# EAGLE design emonDCduo-STM32_v0.2 (EAGLE 9.6.2)
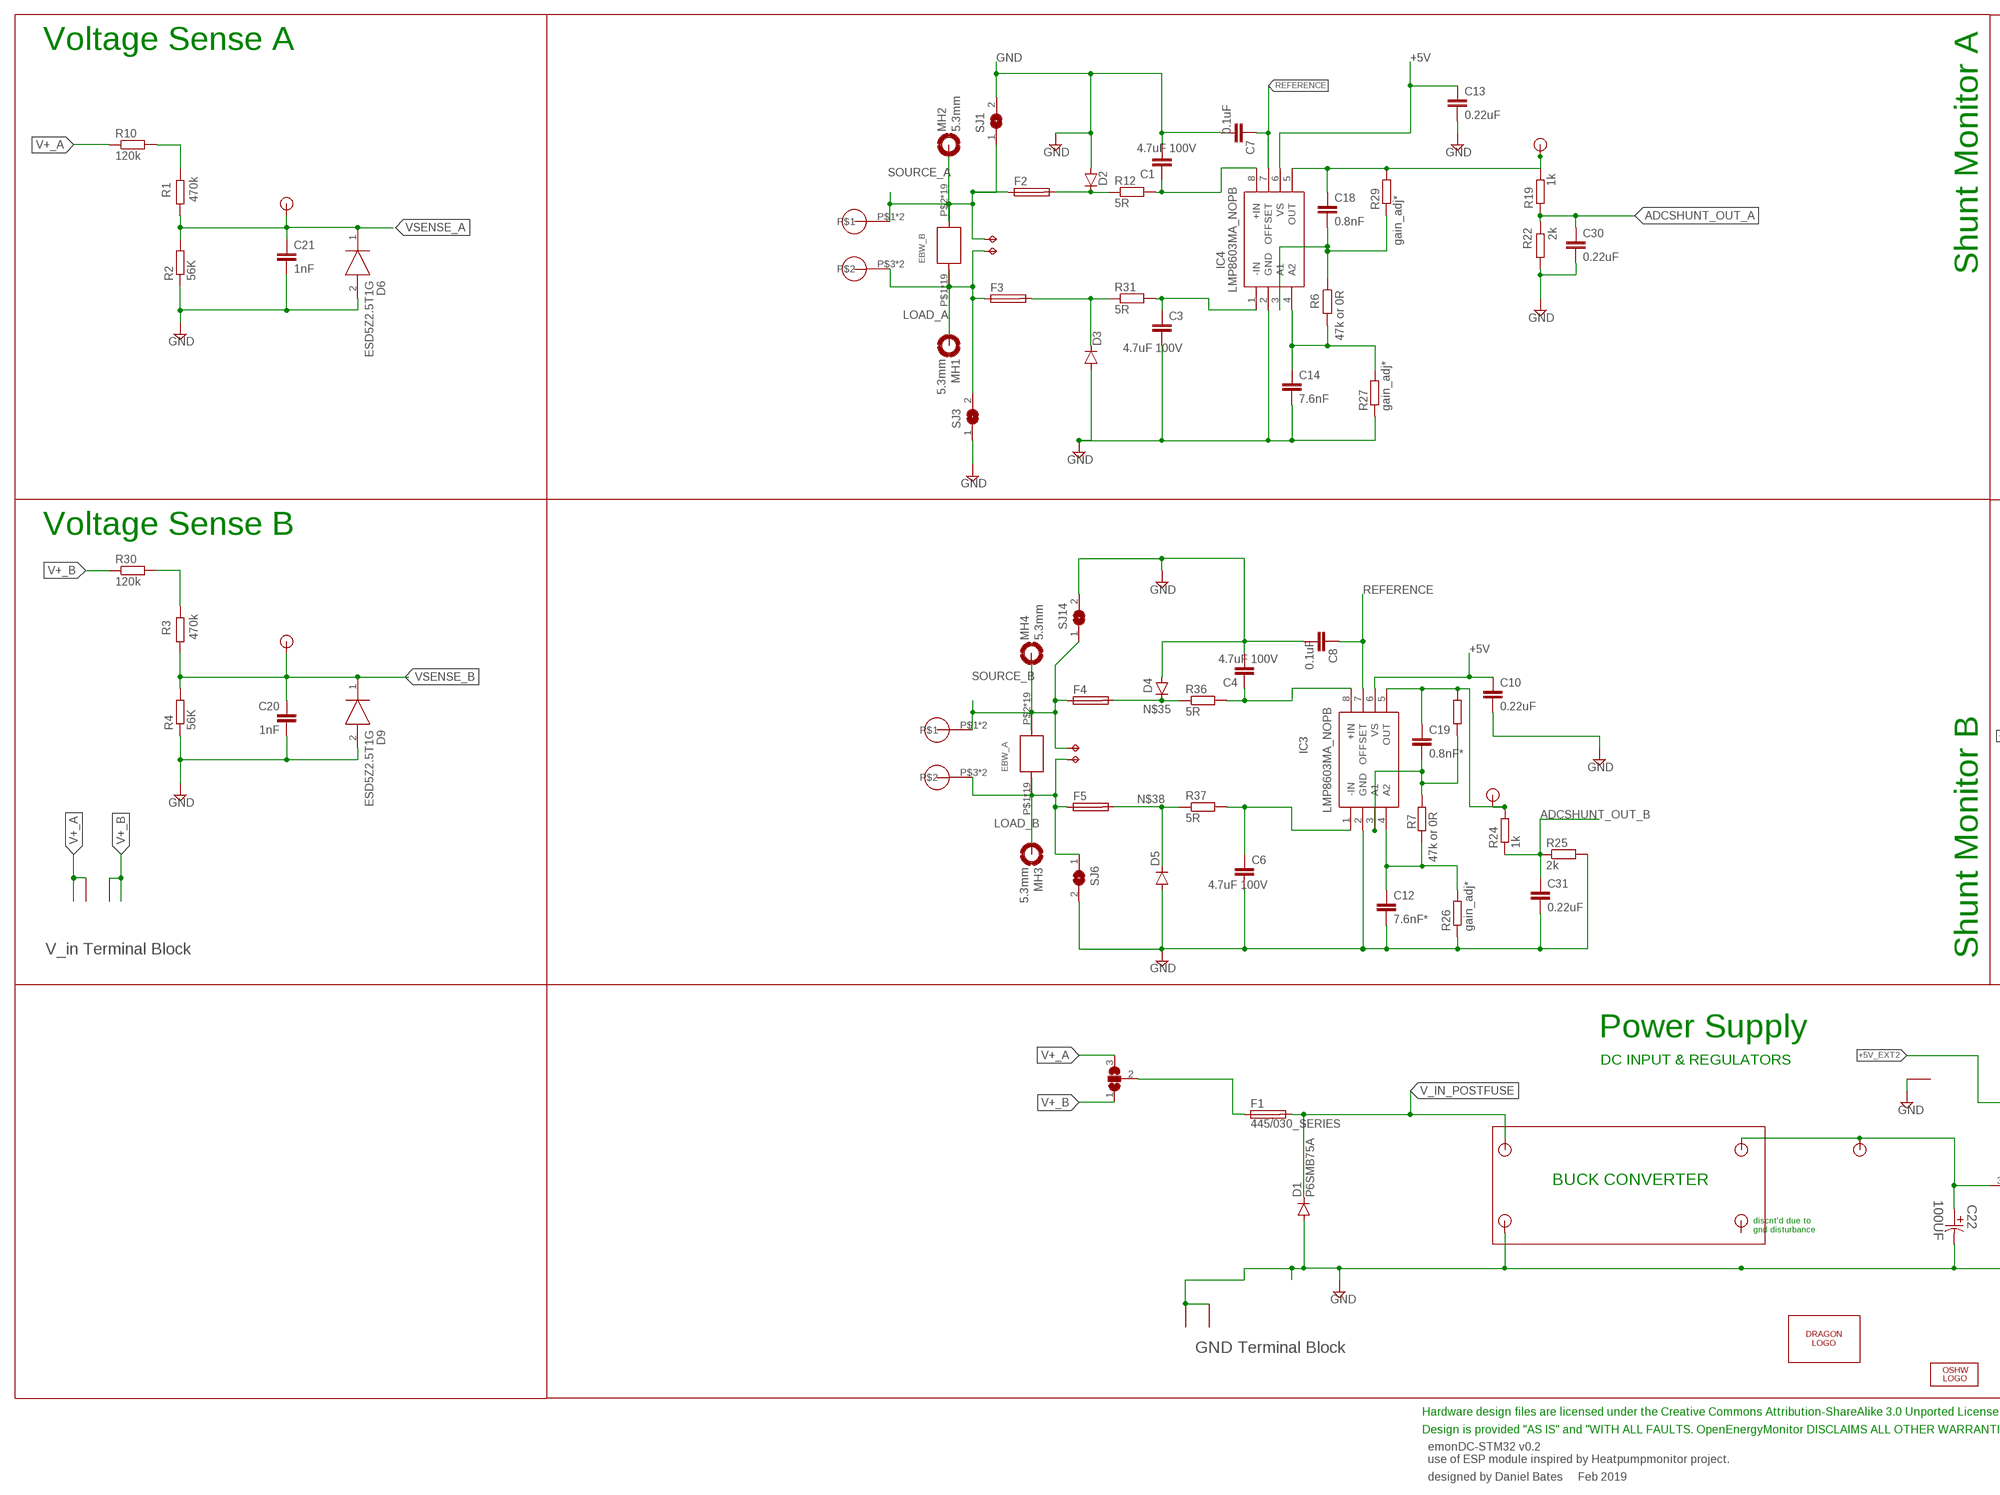
[diagram p0: schematic, sheet 1, part 1 of 2]
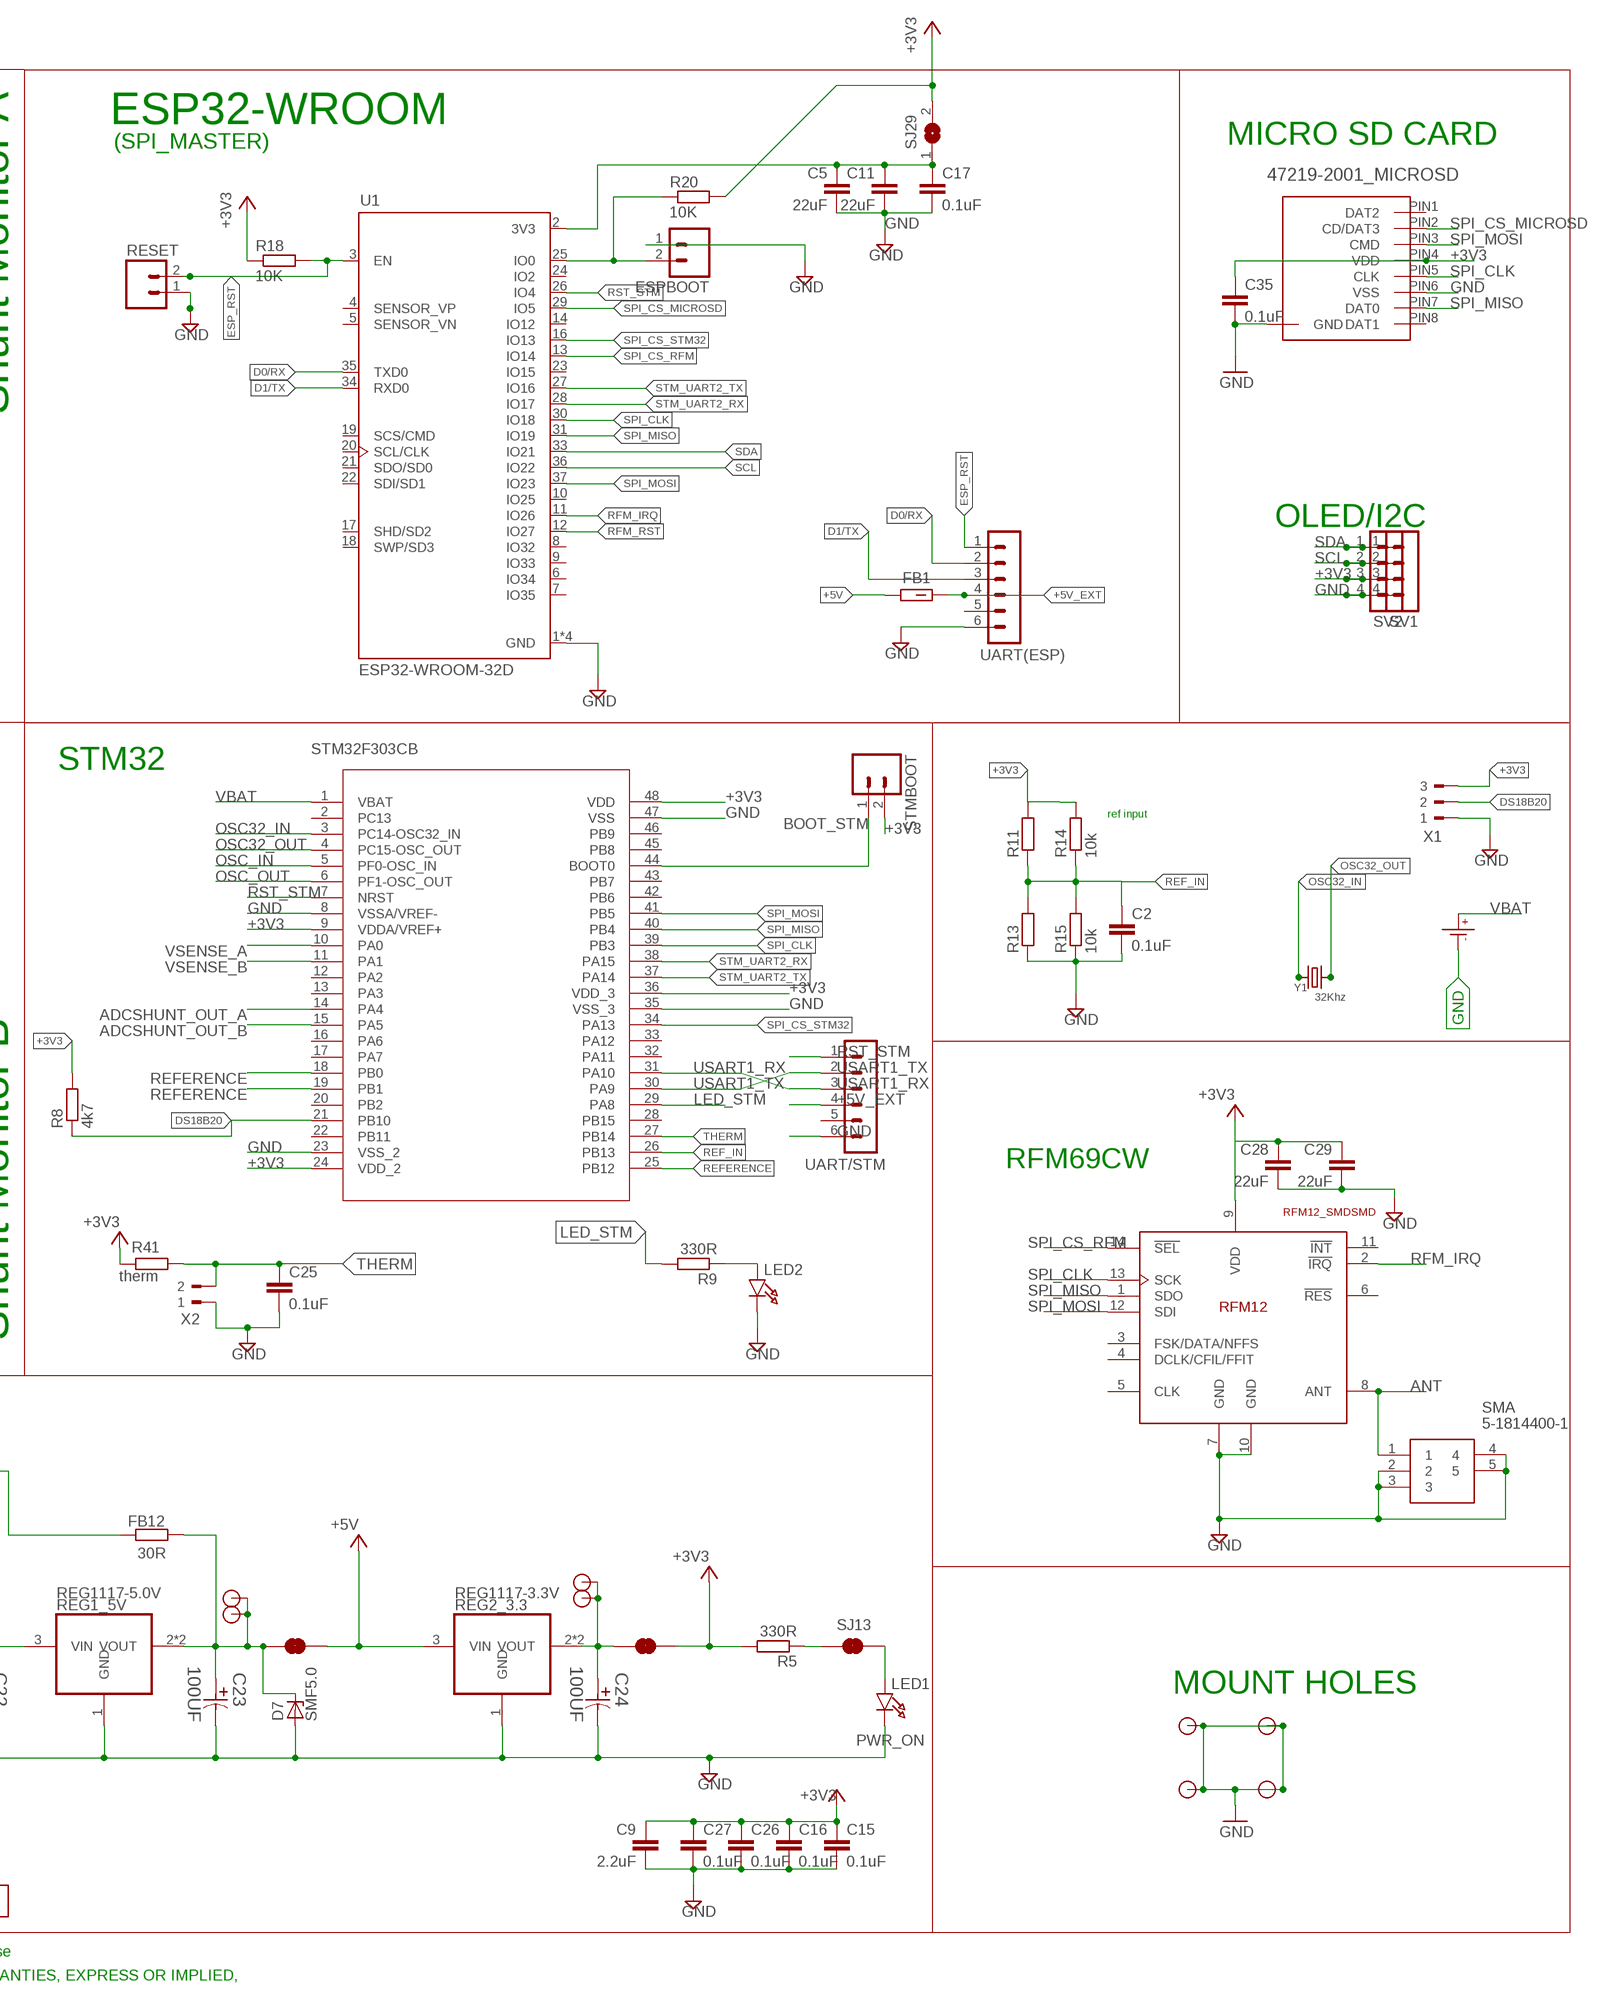
[diagram p1: schematic, sheet 1, part 2 of 2]

## Parts
3V3  JUMPER-SMT_2_NC_TRACE_NO-SILK  [SMT-JUMPER_2_NC_TRACE_NO-SILK]
5V  JUMPER-SMT_2_NC_TRACE_NO-SILK  [SMT-JUMPER_2_NC_TRACE_NO-SILK]
C1  4.7uF 100V  C-EUC1206  [C1206]
C2  0.1uF  C-EUC0603  [C0603]
C3  4.7uF 100V  C-EUC1206  [C1206]
C4  4.7uF 100V  C-EUC1206  [C1206]
C5  22uF  C-EUC0805  [C0805]
C6  4.7uF 100V  C-EUC1206  [C1206]
C7  0.1uF  C-EUC0603  [C0603]
C8  0.1uF  C-EUC0603  [C0603]
C9  2.2uF  C-EUC0805  [C0805]
C10  0.22uF  C-EUC0603  [C0603]
C11  22uF  C-EUC0805  [C0805]
C12  7.6nF*  C-EUC0603  [C0603]
C13  0.22uF  C-EUC0603  [C0603]
C14  7.6nF  C-EUC0603  [C0603]
C15  0.1uF  C-EUC0603  [C0603]
C16  0.1uF  C-EUC0603  [C0603]
C17  0.1uF  C-EUC0603  [C0603]
C18  0.8nF  C-EUC0603  [C0603]
C19  0.8nF*  C-EUC0603  [C0603]
C20  1nF  C-EUC0603  [C0603]
C21  1nF  C-EUC0603  [C0603]
C22  100UF  EEE-0JA101WAR-CASE-C  [CAPAE530X610N]
C23  100UF  EEE-0JA101WAR-CASE-C  [CAPAE530X610N]
C24  100UF  EEE-0JA101WAR-CASE-C  [CAPAE530X610N]
C25  0.1uF  C-EUC0603  [C0603]
C26  0.1uF  C-EUC0603  [C0603]
C27  0.1uF  C-EUC0603  [C0603]
C28  22uF  C-EUC0805  [C0805]
C29  22uF  C-EUC0805  [C0805]
C30  0.22uF  C-EUC0603  [C0603]
C31  0.22uF  C-EUC0603  [C0603]
C35  0.1uF  C-EUC0603  [C0603]
CR1220  CR1220SMD  [CR1220SMD]
D1  P6SMB75A  DIODE-DO214AA  [DO214AA]
D2  P6SMB75A  DIODE-SMB  [SMB]
D3  P6SMB75A  DIODE-SMB  [SMB]
D4  P6SMB75A  DIODE-SMB  [SMB]
D5  P6SMB75A  DIODE-SMB  [SMB]
D6  ESD5Z2.5T1G  [SODFL1608X70N]
D7  SMF5.0  SMF6.0A  [SOD123F]
D9  ESD5Z2.5T1G  [SODFL1608X70N]
EBW_A  EBW_SERIES_15.2MM  [EBW_SERIES_15.2MM]
EBW_B  EBW_SERIES_15.2MM  [EBW_SERIES_15.2MM]
ESPBOOT  M02PTH  [1X02]
F1  445/030_SERIES  [445/030_SERIES_LITTELFUSE]
F2  TR5  [TR5]
F3  TR5  [TR5]
F4  TR5  [TR5]
F5  TR5  [TR5]
FB1  FBCHIP-0603(1608-METRIC)  [BEADC1608X95N]
FB12  30R  R-EU_R0603  [R0603]
IC3  LMP8603MA_NOPB  [SOIC127P600X175-8N]
IC4  LMP8603MA_NOPB  [SOIC127P600X175-8N]
LED1  PWR_ON  LED1206  [CHIPLED_1206]
LED2  PWR_ON  LED1206  [CHIPLED_1206]
LOGO1  OSHW_LOGO_6MILX0200-NT  [OSHW_6X200_NOTEXT]
MH1  5.3mm  MOUNT-PAD-ROUND5.3  [5,3//11-PAD]
MH2  5.3mm  MOUNT-PAD-ROUND5.3  [5,3//11-PAD]
MH3  5.3mm  MOUNT-PAD-ROUND5.3  [5,3//11-PAD]
MH4  5.3mm  MOUNT-PAD-ROUND5.3  [5,3//11-PAD]
MICRO_SD  47219-2001_MICROSD  [47219-2001_MICROSD]
MOUNT_10.16_A  MOLEX_39970-003  [2/10,16]
MOUNT_10.16_B  MOLEX_39970-003  [2/10,16]
R1  470k  R-EU_0207/2V  [0207/2V]
R2  56K  R-EU_R0603  [R0603]
R3  470k  R-EU_0207/2V  [0207/2V]
R4  56K  R-EU_R0603  [R0603]
R5  330R  R-EU_R0603  [R0603]
R6  47k or 0R  R-EU_R0603  [R0603]
R7  47k or 0R  R-EU_R0603  [R0603]
R8  4k7  R-EU_R0603  [R0603]
R9  330R  R-EU_R0603  [R0603]
R10  120k  R-EU_R0603  [R0603]
R11  R-EU_0207/2V  [0207/2V]
R12  5R  R-EU_R0603  [R0603]
R13  R-EU_0207/2V  [0207/2V]
R14  10k  R-EU_R0603  [R0603]
R15  10k  R-EU_R0603  [R0603]
R18  10K  R-EU_R0603  [R0603]
R19  1k  R-EU_R0603  [R0603]
R20  10K  R-EU_R0603  [R0603]
R22  2k  R-EU_R0603  [R0603]
R24  1k  R-EU_R0603  [R0603]
R25  2k  R-EU_R0603  [R0603]
R26  gain_adj*  R-EU_R0603  [R0603]
R27  gain_adj*  R-EU_R0603  [R0603]
R28  gain_adj*  R-EU_R0603  [R0603]
R29  gain_adj*  R-EU_R0603  [R0603]
R30  120k  R-EU_R0603  [R0603]
R31  5R  R-EU_R0603  [R0603]
R36  5R  R-EU_R0603  [R0603]
R37  5R  R-EU_R0603  [R0603]
R41  therm  R-EU_R0603  [R0603]
REG1_5V  REG1117-5.0V  REG1117  [SOT223]
REG2_3.3  REG1117-3.3V  REG1117  [SOT223]
RESET  M02PTH  [1X02]
SJ1  SJ  [SJ]
SJ3  SJ  [SJ]
SJ6  SJ  [SJ]
SJ13  JUMPER-SMT_2_NC_TRACE_NO-SILK  [SMT-JUMPER_2_NC_TRACE_NO-SILK]
SJ14  SJ  [SJ]
SJ15  SJ2W  [SJ_2]
SJ29  SJ  [SJ]
SMA  5-1814400-1  [518144001]
STM32F303CB  STM32F303CB_STM32F302_303C2  [STM32F303CB_LQFP48-7X7MM]
STMBOOT  M02PTH  [1X02]
SV1  MA04-1  [MA04-1]
SV2  MA04-1  [MA04-1]
TP8  TPPAD1-13Y  [P1-13Y]
TP9  TPPAD1-13Y  [P1-13Y]
TP10  TPPAD1-13Y  [P1-13Y]
TP11  TPPAD1-13Y  [P1-13Y]
U1  ESP32-WROOM-32D  [MODULE_ESP32-WROOM-32D]
U$1  TP0.8MM  [TP0.8]
U$2  2212S-02SG-85  TP_2_LONG  [TP0.8_X2]
U$3  2212S-02SG-85  TP_2_LONG  [TP0.8_X2]
U$4  TP0.8MM  [TP0.8]
U$5  TP0.8MM  [TP0.8]
U$6  TP0.8MM  [TP0.8]
U$7  TP0.8MM  [TP0.8]
U$8  TP0.8MM  [TP0.8]
U$9  TP0.8MM  [TP0.8]
U$10  2212S-02SG-85  TP_2_LONG  [TP0.8_X2]
U$11  2212S-02SG-85  TP_2_LONG  [TP0.8_X2]
U$14  RFM12_SMDSMD  [RFM12]
U$15  7.62MM_TERMINAL_BLOCK  [7.62MM]
U$16  7.62MM_TERMINAL_BLOCK  [7.62MM]
U$17  7.62MM_TERMINAL_BLOCK  [7.62MM]
U$18  TP0.8MM  [TP0.8]
U$19  TP0.8MM  [TP0.8]
U$22  TP3.5MM  [TP3.5]
U$23  TP3.5MM  [TP3.5]
U$24  TP3.5MM  [TP3.5]
U$25  TP3.5MM  [TP3.5]
U$26  DRAGON  [DRAGON_LOGO]
UART(ESP)  UART/ESP  MA06-1  [MA06-1]
UART/STM  UART/STM  MA06-1  [MA06-1]
X1  180-3  [180-3]
X2  180-2  [180-2]
Y1  32Khz  CRYSTAL8X3.8SMT  [CRYSTAL_8X3.8]

## Nets
3.3V_ [thick_power]: 3V3.1 C24.1 REG2_3.3.2(VOUT) REG2_3.3.4(VOUT) U$8.P$1 U$19.P$1
5V_ [thick_power]: 5V.1 C23.1 D7.C FB12.1 REG1_5V.2(VOUT) REG1_5V.4(VOUT) U$7.P$1 U$18.P$1
6.5V [thick_power]: C22.1 REG1_5V.3(VIN) U$9.P$1 U$10.P$1 U$10.P$2
+3V3 [thin_power]: 3V3.2 C9.1 C15.1 C16.1 C26.1 C27.1 C28.1 C29.1 C35.1 MICRO_SD.PIN4(VDD) R5.2 R8.2 R11.2 R14.2 R18.1 R20.2 R41.2 SJ29.2 STM32F303CB.9(VDDA/VREF+) STM32F303CB.24(VDD_2) STM32F303CB.36(VDD_3) STM32F303CB.48(VDD) STMBOOT.2 SV1.3 SV2.3 U$14.9(VDD) X1.3
+3V3_ESP [thin_power]: C5.1 C11.1 C17.1 SJ29.1 U1.2(3V3)
+5V [thick_power]: 5V.2 C10.1 C13.1 FB1.1 IC3.6(VS) IC4.6(VS) REG2_3.3.3(VIN)
+5V_EXT [thick_power]: FB1.2 UART(ESP).4 UART/STM.4
+5V_EXT2 [thick_power]: FB12.2 U$17.P$1
ADCSHUNT_OUT_A: C30.1 R19.1 R22.1 STM32F303CB.14(PA4)
ADCSHUNT_OUT_A_: C18.1 IC4.5(OUT) R19.2 R29.2 U$6.P$1
ADCSHUNT_OUT_B: C31.1 R24.1 R25.1 STM32F303CB.15(PA5)
ADCSHUNT_OUT_B_: C19.1 IC3.5(OUT) R24.2 R28.2 U$5.P$1
ANT: SMA.1 U$14.8(ANT)
BOOT_STM: STM32F303CB.44(BOOT0) STMBOOT.1
D0/RX: U1.35(TXD0) UART(ESP).2
D1/TX: U1.34(RXD0) UART(ESP).3
DS18B20: R8.1 STM32F303CB.21(PB10) X1.2
ESP_RST: R18.2 RESET.2 U1.3(EN) UART(ESP).1
GND: C1.2 C2.2 C3.2 C4.2 C5.2 C6.2 C7.2 C8.2 C9.2 C10.2 C11.2 C12.2 C13.2 C14.2 C15.2 C16.2 C17.2 C20.2 C21.2 C22.2 C23.2 C24.2 C25.2 C26.2 C27.2 C28.2 C29.2 C30.2 C31.2 C35.2 CR1220.P-(P$-) D1.A D2.A D3.A D4.A D5.A D6.2(A) D7.A D9.2(A) ESPBOOT.1 IC3.2(GND) IC4.2(GND) LED1.C LED2.C MICRO_SD.P$1(GND) MICRO_SD.P$2(GND) MICRO_SD.P$3(GND) MICRO_SD.P$4(GND) MICRO_SD.PIN6(VSS) R2.1 R4.1 R13.1 R15.1 R22.2 R25.2 R26.1 R27.1 REG1_5V.1(GND) REG2_3.3.1(GND) RESET.1 SJ1.2 SJ3.1 SJ6.2 SJ14.2 SMA.2 SMA.3 SMA.4 SMA.5 STM32F303CB.8(VSSA/VREF-) STM32F303CB.23(VSS_2) STM32F303CB.35(VSS_3) STM32F303CB.47(VSS) SV1.4 SV2.4 U1.1(GND) U1.15(GND) U1.38(GND) U1.39(GND) U$3.P$1 U$3.P$2 U$14.7(GND) U$14.10(GND) U$16.P$1 U$16.P$2 U$17.P$2 U$22.P$1 U$23.P$1 U$24.P$1 U$25.P$1 UART(ESP).6 UART/STM.6 X1.1 X2.1
LED_STM: R9.2 STM32F303CB.29(PA8)
LOAD_A [HV]: EBW_B.P$1 EBW_B.P$3 EBW_B.P$4 EBW_B.P$5 EBW_B.P$6 EBW_B.P$7 EBW_B.P$8 EBW_B.P$9 EBW_B.P$10 EBW_B.P$11 EBW_B.P$12 EBW_B.P$13 EBW_B.P$14 EBW_B.P$15 EBW_B.P$16 EBW_B.P$17 EBW_B.P$33 EBW_B.P$34 EBW_B.P$35 F3.1 MH1.B5,5(MOUNT) MOUNT_10.16_A.P$3 MOUNT_10.16_A.P$4 SJ3.2 TP10.TP
LOAD_B [HV]: EBW_A.P$1 EBW_A.P$3 EBW_A.P$4 EBW_A.P$5 EBW_A.P$6 EBW_A.P$7 EBW_A.P$8 EBW_A.P$9 EBW_A.P$10 EBW_A.P$11 EBW_A.P$12 EBW_A.P$13 EBW_A.P$14 EBW_A.P$15 EBW_A.P$16 EBW_A.P$17 EBW_A.P$33 EBW_A.P$34 EBW_A.P$35 F5.1 MH3.B5,5(MOUNT) MOUNT_10.16_B.P$3 MOUNT_10.16_B.P$4 SJ6.1 TP8.TP
LOAD_B_T [thin_power]: C6.1 IC3.1(-IN) R37.2
LOAD_T_A [thin_power]: C3.1 IC4.1(-IN) R31.2
N$3: C14.1 IC4.4(A2) R6.2 R27.2
N$4: C18.2 IC4.3(A1) R6.1 R29.1
N$5: R5.1 SJ13.1
N$6: LED1.A SJ13.2
N$10: F1.P$1 F1.P$2 SJ15.2
N$11: R3.1 R30.2
N$24: R1.1 R10.2
N$25: C19.2 IC3.3(A1) R7.1 R28.1
N$27: C12.1 IC3.4(A2) R7.2 R26.2
N$28: ESPBOOT.2 R20.1 U1.25(IO0)
N$31: LED2.A R9.1
N$33 [thin_power]: D2.C F2.2 R12.1
N$34 [thin_power]: D3.C F3.2 R31.1
N$35 [thin_power]: D4.C F4.2 R36.1
N$38 [thin_power]: D5.C F5.2 R37.1
OSC32_IN: STM32F303CB.3(PC14-OSC32_IN) Y1.P$1
OSC32_OUT: STM32F303CB.4(PC15-OSC_OUT) Y1.P$4
OSC_IN: STM32F303CB.5(PF0-OSC_IN)
OSC_OUT: STM32F303CB.6(PF1-OSC_OUT)
REF_IN: C2.1 R11.1 R13.2 R14.1 R15.2 STM32F303CB.26(PB13)
REFERENCE: C7.1 C8.1 IC3.7(OFFSET) IC4.7(OFFSET) STM32F303CB.18(PB0) STM32F303CB.19(PB1) STM32F303CB.25(PB12)
RFM_IRQ: U1.11(IO26) U$14.2(!IRQ)
RFM_RST: U1.12(IO27)
RST_STM: STM32F303CB.7(NRST) U1.26(IO4) UART/STM.1
SCL: SV1.2 SV2.2 U1.36(IO22)
SDA: SV1.1 SV2.1 U1.33(IO21)
SOURCE_A [HV]: EBW_B.P$2 EBW_B.P$18 EBW_B.P$19 EBW_B.P$20 EBW_B.P$21 EBW_B.P$22 EBW_B.P$23 EBW_B.P$24 EBW_B.P$25 EBW_B.P$26 EBW_B.P$27 EBW_B.P$28 EBW_B.P$29 EBW_B.P$30 EBW_B.P$31 EBW_B.P$32 EBW_B.P$36 EBW_B.P$37 EBW_B.P$38 F2.1 MH2.B5,5(MOUNT) MOUNT_10.16_A.P$1 MOUNT_10.16_A.P$2 SJ1.1 TP11.TP
SOURCE_B [HV]: EBW_A.P$2 EBW_A.P$18 EBW_A.P$19 EBW_A.P$20 EBW_A.P$21 EBW_A.P$22 EBW_A.P$23 EBW_A.P$24 EBW_A.P$25 EBW_A.P$26 EBW_A.P$27 EBW_A.P$28 EBW_A.P$29 EBW_A.P$30 EBW_A.P$31 EBW_A.P$32 EBW_A.P$36 EBW_A.P$37 EBW_A.P$38 F4.1 MH4.B5,5(MOUNT) MOUNT_10.16_B.P$1 MOUNT_10.16_B.P$2 SJ14.1 TP9.TP
SOURCE_B_T [thin_power]: C4.1 IC3.8(+IN) R36.2
SOURCE_T_A [thin_power]: C1.1 IC4.8(+IN) R12.2
SPI_CLK: MICRO_SD.PIN5(CLK) STM32F303CB.39(PB3) U1.30(IO18) U$14.13(SCK)
SPI_CS_MICROSD: MICRO_SD.PIN2(CD/DAT3) U1.29(IO5)
SPI_CS_RFM: U1.13(IO14) U$14.14(!SEL)
SPI_CS_STM32: STM32F303CB.34(PA13) U1.16(IO13)
SPI_MISO: MICRO_SD.PIN7(DAT0) STM32F303CB.40(PB4) U1.31(IO19) U$14.1(SDO)
SPI_MOSI: MICRO_SD.PIN3(CMD) STM32F303CB.41(PB5) U1.37(IO23) U$14.12(SDI)
STM_UART2_RX: STM32F303CB.38(PA15) U1.28(IO17)
STM_UART2_TX: STM32F303CB.37(PA14) U1.27(IO16)
THERM: C25.1 R41.1 STM32F303CB.27(PB14) X2.2
USART1_RX: STM32F303CB.31(PA10) UART/STM.3
USART1_TX: STM32F303CB.30(PA9) UART/STM.2
V+_A [HV]: R10.1 SJ15.3 U$15.P$2
V+_B [HV]: R30.1 SJ15.1 U$15.P$1
V_IN_POSTFUSE [HV]: D1.C F1.P$3 F1.P$4 U$2.P$1 U$2.P$2
VBAT: CR1220.P+(P$+) STM32F303CB.1(VBAT)
VSENSE_A: C21.1 D6.1(K) R1.2 R2.2 STM32F303CB.10(PA0) U$1.P$1
VSENSE_B: C20.1 D9.1(K) R3.2 R4.2 STM32F303CB.11(PA1) U$4.P$1
Unconnected: MICRO_SD.PIN1(DAT2) MICRO_SD.PIN8(DAT1) STM32F303CB.2(PC13) STM32F303CB.12(PA2) STM32F303CB.13(PA3) STM32F303CB.16(PA6) STM32F303CB.17(PA7) STM32F303CB.20(PB2) STM32F303CB.22(PB11) STM32F303CB.28(PB15) STM32F303CB.32(PA11) STM32F303CB.33(PA12) STM32F303CB.42(PB6) STM32F303CB.43(PB7) STM32F303CB.45(PB8) STM32F303CB.46(PB9) U1.4(SENSOR_VP) U1.5(SENSOR_VN) U1.6(IO34) U1.7(IO35) U1.8(IO32) U1.9(IO33) U1.10(IO25) U1.14(IO12) U1.17(SHD/SD2) U1.18(SWP/SD3) U1.19(SCS/CMD) U1.20(SCL/CLK) U1.21(SDO/SD0) U1.22(SDI/SD1) U1.23(IO15) U1.24(IO2) U$11.P$1 U$11.P$2 U$14.3(FSK/DATA/NFFS) U$14.4(DCLK/CFIL/FFIT) U$14.5(CLK) U$14.6(!RES) U$14.11(!INT) UART(ESP).5 UART/STM.5

## Notes on the sheet
- Shunt Monitor A
- Voltage Sense A | ESP32-WROOM
- (SPI_MASTER) | MICRO SD CARD
- OLED/I2C
- Voltage Sense B | STM32
- ref input
- RFM69CW
- V_in Terminal Block | Shunt Monitor B
- Power Supply
- DC INPUT & REGULATORS
- BUCK CONVERTER
- MOUNT HOLES
- discnt'd due to 
  gnd disturbance
- GND Terminal Block
- Hardware design files are licensed under the Creative Commons Attribution-ShareAlike 3.0 Unported License
- Design is provided "AS IS" and "WITH ALL FAULTS. OpenEnergyMonitor DISCLAIMS ALL OTHER WARRANTIES, EXPRESS OR IMPLIED,
- emonDC-STM32 v0.2
  use of ESP module inspired by Heatpumpmonitor project.
- designed by Daniel Bates     Feb 2019

## Library data of the parts
3V3 5V SJ13 = SparkFun-Jumpers:JUMPER-SMT_2_NC_TRACE: Normally closed trace jumper This jumper has a trace between two pads so it's normally closed (NC). Use a razor knife to open the connection. For best results follow the IPC guidelines for cutting traces: Cutout at least 0.063 mm (0.005 in). Remove all loose material to clean up the cut area. Seal the cut with an approved epoxy. Reapply solder to reclose the connection.
C1 C3 C4 C6-C8 C10 C13 C14 C18-C21 C30 C31 = rcl:C-EU: CAPACITOR, European symbol; MPN: C1608X7S2A104K080AB; SPICEPREFIX: C
C2 C5 C9 C11 C12 C15-C17 C25-C29 C35 = rcl:C-EU: CAPACITOR, European symbol; SPICEPREFIX: C
C22-C24 = Panasonic-EEE0_EEE1_EEE2_EEEFC:EEE-: Aluminum Electrolytic Capacitors,Surface Mount Type; MPN: EEE-0JA101WAR; OC_FARNELL: 2284723; OC_NEWARK: 53W3731; PACKAGE: CASE-C; SUPPLIER: PANASONIC; TOLERANCE: 20%; VOLTAGERATING: 6.3V
CR1220 = IotaWatt_parts:CR1220SMD: CR1220 Battery SMD; MPN: Harwin S8411-45R
D1-D5 = diode:DIODE-: DIODE
D6 D9 = ESD5Z2.5T1G:ESD5Z2.5T1G: Source: Datasheet <http://uk.rs-online.com/web/p/products/7862909P>; ALLIED_NUMBER: 70339618; HEIGHT: 0.7mm; MANUFACTURER_NAME: ON Semiconductor; MANUFACTURER_PART_NUMBER: ESD5Z2.5T1G; RS_PART_NUMBER: 7862909P; RS_PRICE-STOCK: http://uk.rs-online.com/web/p/products/7862909P
D7 = smf_10:SMF*A: SMF Series TVS Diodes Source: http://www.littelfuse.com/~/media/electronics/datasheets/tvs_diodes/littelfuse_tvs_diode_smf_datasheet.pdf.pdf; MF: Littelfuse; MPN: SMF6.0A; OC_FARNELL: unknown; OC_NEWARK: unknown
EBW_A EBW_B = EBW series SHUNT:EBW_SERIES_15.2MM
ESPBOOT RESET STMBOOT = SparkFun:M02: Header 2 Standard 2-pin 0.1" header. Use with straight break away headers (SKU : PRT-00116), right angle break away headers (PRT-00553), swiss pins (PRT-00743), machine pins (PRT-00117), and female headers (PRT-00115). Molex polarized connector foot print use with SKU : PRT-08233 with associated crimp pins and housings.
F1 = LITTELFUSE 455:030 SERIES:445/030_SERIES: MPN 04450001N
F2-F5 = fuse_db:TR5: FUSE Wickmann; MF: LITTELFUSE; MPN: 56000001009; OC_FARNELL: 1185363; OC_NEWARK: unknown
FB1 = Filter:FB: Ferrite Bead - Generic; CATEGORY: Filter; SUB-CATEGORY: Ferrite bead
FB12 = rcl7:R-EU_: RESISTOR, European symbol
IC3 IC4 = LMP8603MA_NOPB:LMP8603MA_NOPB: 60-V, Bi-Directional, Low- or High-Side, Voltage Output Current Sensing Amplifier Source: Datasheet <http://uk.rs-online.com/web/p/products/7616334P>; DESCRIPTION: 60-V, Bi-Directional, Low- or High-Side, Voltage Output Current Sensing Amplifier; HEIGHT: 1.75mm; MANUFACTURER_NAME: Texas Instruments; MANUFACTURER_PART_NUMBER: LMP8603MA/NOPB; RS_PART_NUMBER: 7616334P; RS_PRICE-STOCK: http://uk.rs-online.com/web/p/products/7616334P
LED1 LED2 = microbuilder:LED: LED 0603 - 0603 Surface Mount Package 2mA: Green LED - Low Power (3.9mcd, 2ma, 1.7Vf) - Digikey: 475-2709-2-ND Orange LED - Low Power (9.8mcd, 2ma, 1.8Vf) - Digikey: 475-1194-2-ND Red LED - Low Power (5mcd, 2ma, 1.8Vf) - Digikey: 475-1195-2-ND Yellow LED - Low Power (7mcd, 2ma, 1.8Vf) - Digikey: 475-1196-2-ND 5mA: Blue LED - Low Power (17mcd, 5ma, 2.9Vf) - Digikey: LNJ937W8CRACT-ND 0805 - 0805 Surface Mount Package 2mA: Red LED (8.8mcd, 2mA, 1.8Vf, Clear) - Low Power [Digikey: 475-2510-1-ND] Green LED (5mcd, 2mA, 1.8Vf, Clear) - Low Power [Digikey: 475-2730-1-ND] Yellow LED (11.3mcd, 2mA, 1.8Vf, Clear) - Low Power [Digikey: 475-2555-1-ND] 20mA: Red LED (104mcd, 20mA, Diffused) - LS R976 [Digikey: 475-1278-6-ND] Red LED (12mcd, 20mA, 2.0Vf, Clear) - APT2012EC [Digikey: 754-1128-1-ND] Green LED (15mcd, 20mA, 2.2Vf, Clear) - APT2012GC [Digikey: 754-1131-1-ND] Orange LED (160mcd, 20mA, 2.1Vf, Clear) - APT2012SECK [Digikey: 754-1130-1-ND] 1206 - 1206 Surface Mount Package Green LED (26mcd, 20mA, Diffused) - LG N971 [Digikey: 475-1407-6-ND] Red LED (15mcd, 20mA, Diffused) - LH N974 [Digikey: 475-1416-6-ND]
LOGO1 = ohw-logo:OSHW_LOGO_6MIL; OC_FARNELL: unknown
MH1-MH4 = holes-db:MOUNT-PAD-ROUND: MOUNTING PAD, round
MICRO_SD = MOLEX 47219-2001:47219-2001_MICROSD
MOUNT_10.16_A MOUNT_10.16_B = 10.16mm terminal block:MOLEX_39970-003
R1 R3 = rcl7:R-EU_: RESISTOR, European symbol; MPN: MCMF006FF1004A50
R2 R4 = rcl:R-EU_: RESISTOR, European symbol; MPN: MCMF006FF7502A50; SPICEPREFIX: R
R5 R8 R9 R11 R13-R15 R41 = rcl:R-EU_: RESISTOR, European symbol; SPICEPREFIX: R
R6 R7 R18 R20 = rcl:R-EU_: RESISTOR, European symbol
R10 R12 R19 R22 R24-R31 R36 R37 = rcl:R-EU_: RESISTOR, European symbol; MPN: MCMF006FF1004A50; SPICEPREFIX: R
REG1_5V = burr-brown-db:REG1117: 800mA and 1A Low Dropout (LDO) Positive Regulator 1.8V, 2.5V, 2.85V, 3.3V, 5V, and Adj; MF: TEXAS INSTRUMENTS; MPN: REG1117-5.0; OC_FARNELL: 1097566; OC_NEWARK: 14P6981
REG2_3.3 = burr-brown-db:REG1117: 800mA and 1A Low Dropout (LDO) Positive Regulator 1.8V, 2.5V, 2.85V, 3.3V, 5V, and Adj; MF: TEXAS INSTRUMENTS; MPN: REG1117-3.3; OC_FARNELL: 1097566; OC_NEWARK: 14P6981
SJ1 SJ3 SJ6 SJ14 SJ29 = jumper:SJ: SMD solder JUMPER
SJ15 = jumper:SJ2W: SMD solder JUMPER
SMA = 5-1814400-1 sma connector:5-1814400-1: SMA Connector Jack, Female Socket 50 Ohm Through Hole, Right Angle Solder Source: Datasheet <http://uk.rs-online.com/web/p/products/6163400>; ALLIED_NUMBER: 70084631; DESCRIPTION: SMA Connector Jack, Female Socket 50 Ohm Through Hole, Right Angle Solder; HEIGHT: 10.43mm; MANUFACTURER_NAME: TE Connectivity; MANUFACTURER_PART_NUMBER: 5-1814400-1; RS_PART_NUMBER: 6163400; RS_PRICE-STOCK: http://uk.rs-online.com/web/p/products/6163400
STM32F303CB = stm32hw05:STM32F303CB_STM32F302_303C2; MANUFACTURER_PART_NUMBER: STM32F303CB; VENDOR: STMicroelectronics
SV1 SV2 = con-lstb-db:MA04-1: PIN HEADER; MF: MULTICOMP; MPN: 2212S-04SG-85; OC_FARNELL: 1593460; OC_NEWARK: unknown
TP8-TP11 = testpad:TP: Test pad
U1 = ESP32-WROOM-32D:ESP32-WROOM-32D: IC: SoC; GPIO, I2C, I2S, IR, SD, SDIO, SPI, UART; 2.7÷3.6VDC; 20dBm; AVAILABILITY: Unavailable; DESCRIPTION: IC: SoC; GPIO, I2C, I2S, IR, SD, SDIO, SPI, UART; 2.7÷3.6VDC; 20dBm; MF: Espressif Systems; MP: ESP32-WROOM-32D; PACKAGE: Module Espressif Systems; PRICE: None
U$1 U$4-U$9 U$18 U$19 U$22-U$25 = testpad_db:TP
U$2 U$3 U$10 U$11 = testpad_db:TP_2_LONG; MPN: 2212S-02SG-85
U$14 = rfm12b _ rfm69cw:RFM12_SMD: RFM12 is a low costing ISM band transceiver module implemented with unique PLL. It works signal ranges from 315/433/868/915MHZ bands, comply with FCC, ETSI regulation. The SPI interface is used to communicate with microcontroller for parameter setting.
U$15-U$17 = 7.62mm terminal block:7.62MM_TERMINAL_BLOCK
U$26 = DRAGON_LOGO:DRAGON
UART(ESP) UART/STM = JeeLabs:MA06-1: PIN HEADER
X1 = con-weidmueller-sl35:180-3: WEIDMUELLER CLAMP CONNECTOR; OC_FARNELL: unknown; OC_NEWARK: unknown
X2 = con-weidmueller-sl35:180-2: WEIDMUELLER CLAMP CONNECTOR; OC_FARNELL: unknown; OC_NEWARK: unknown
Y1 = microbuilder:CRYSTAL: Crystals HC49UP - Surface Mount Crystal 4.0MHz 18pF +/-30ppm Surface Mount Crystal [Digikey: 535-9857-1-ND] 12.0 MHz Surface Mount Crystal [Digikey: 535-9869-6-ND] 25.0 MHz Surface Mount Crystal [Digikey: 535-9078-1-ND] 2.5 x 2.0mm - MEMs SMT Crystal 16.0 MHz 10pF 20ppm 2.5 x 2.0mm Crystal [Digikey -40-85°C: 535-10923-1-ND] 3.2 x 2.5mm - MEMs SMT Crystal 12.0 MHz 8pF 15ppm 3.2 x 2.5mm Crystal [Digikey: -10-70°C: 644-1047-1-ND -40-125°C: 644-1128-1-ND] 16.0 MHz 8pF 15ppm 3.2 x 2.5mm Crystal [Digikey: -10-70°C: 644-1049-1-ND -40-125°C: 644-1129-2-ND] 16.0 MHz 10pF 10ppm 3.2 x 2.5mm Crystal [Digikey: 644-1100-1-ND] 27.12 MHz 18pF 30ppm 3.2 x 2.5mm Crystal [Digikey: 887-1424-1-ND] 27.12MHz 10pF 10ppm 3.2 x 2.5mm Crystal [Digikey: 887-1329-1-ND] 4.9 x 1.8mm - MEMs SMT Crystal 32.768 KHz 12.5pF 20ppm 4.9 x 1.8mm Crystal [Digikey: SE2415CT-ND] 8.0 x 3.8mm - Surface Mount Crystal 32.768kHz 12.5pF 20ppm -40°C-85°C [Digikey: 535-9166-2-ND] Cylinder 32.768KHz Cylinder Crystal (2x6mm body) [Ex. Digikey: 300-8341-2-ND]

## Net classes
0 default: width 0.203 mm, drill 0.5 mm, clearance 0.178 mm
1 power: width 0.254 mm, drill 0.5 mm, clearance 0.178 mm
2 thin_power: width 0.254 mm, drill 0.5 mm, clearance 0.178 mm
3 thick_power: width 0.406 mm, drill 0.5 mm, clearance 0.178 mm
4 HV: width 0.406 mm, drill 0.5 mm, clearance 0.762 mm

## Board
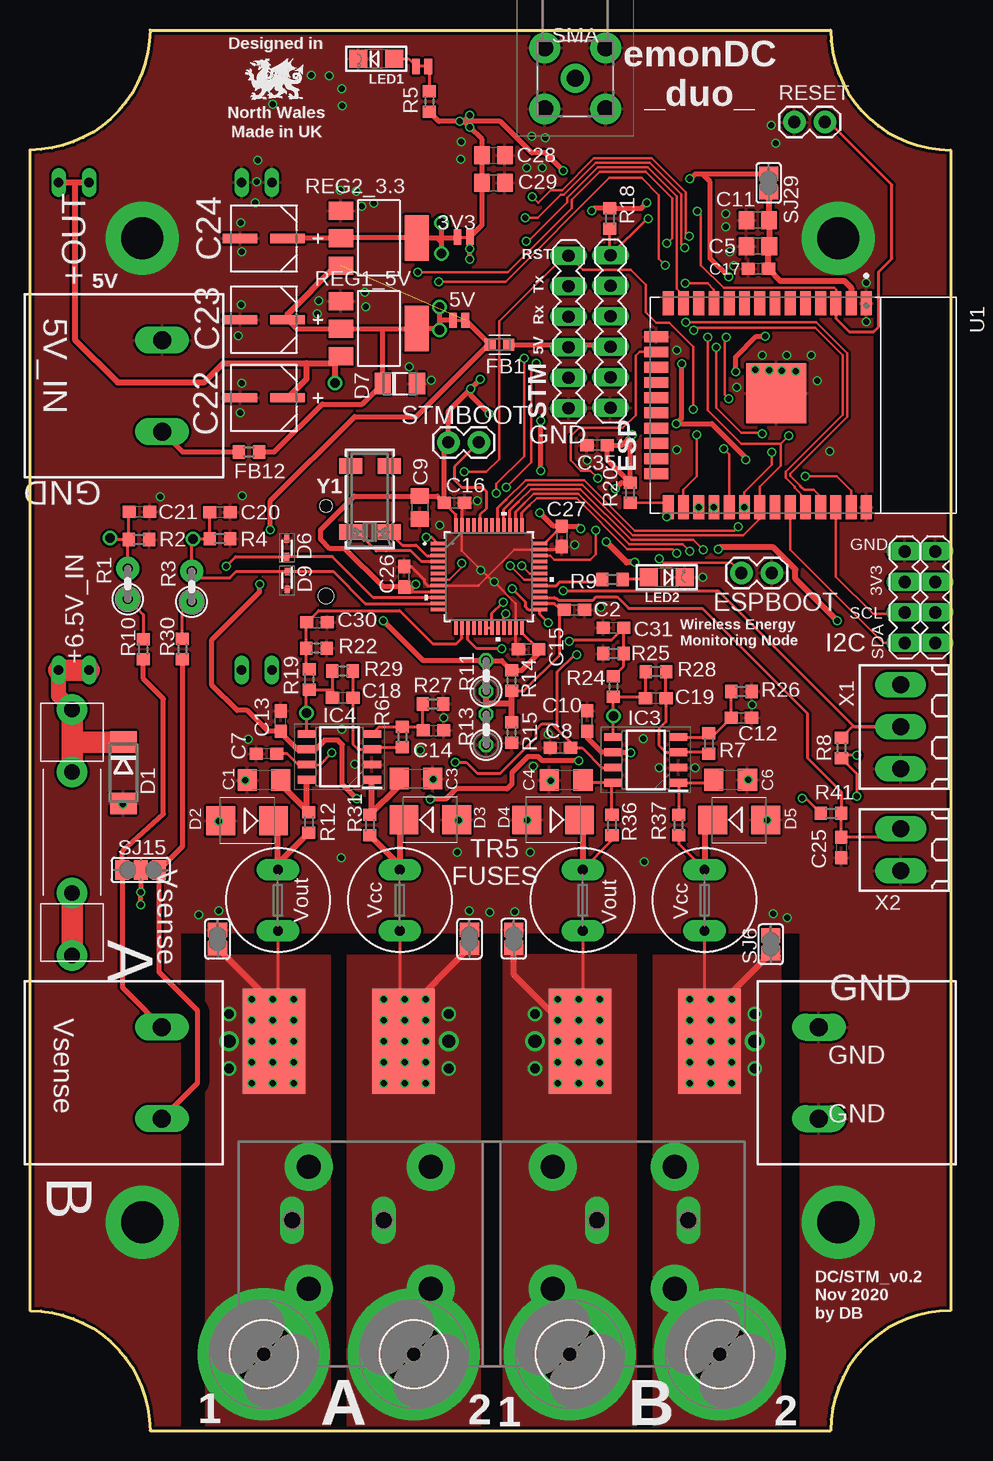
[diagram p2: board, top side]
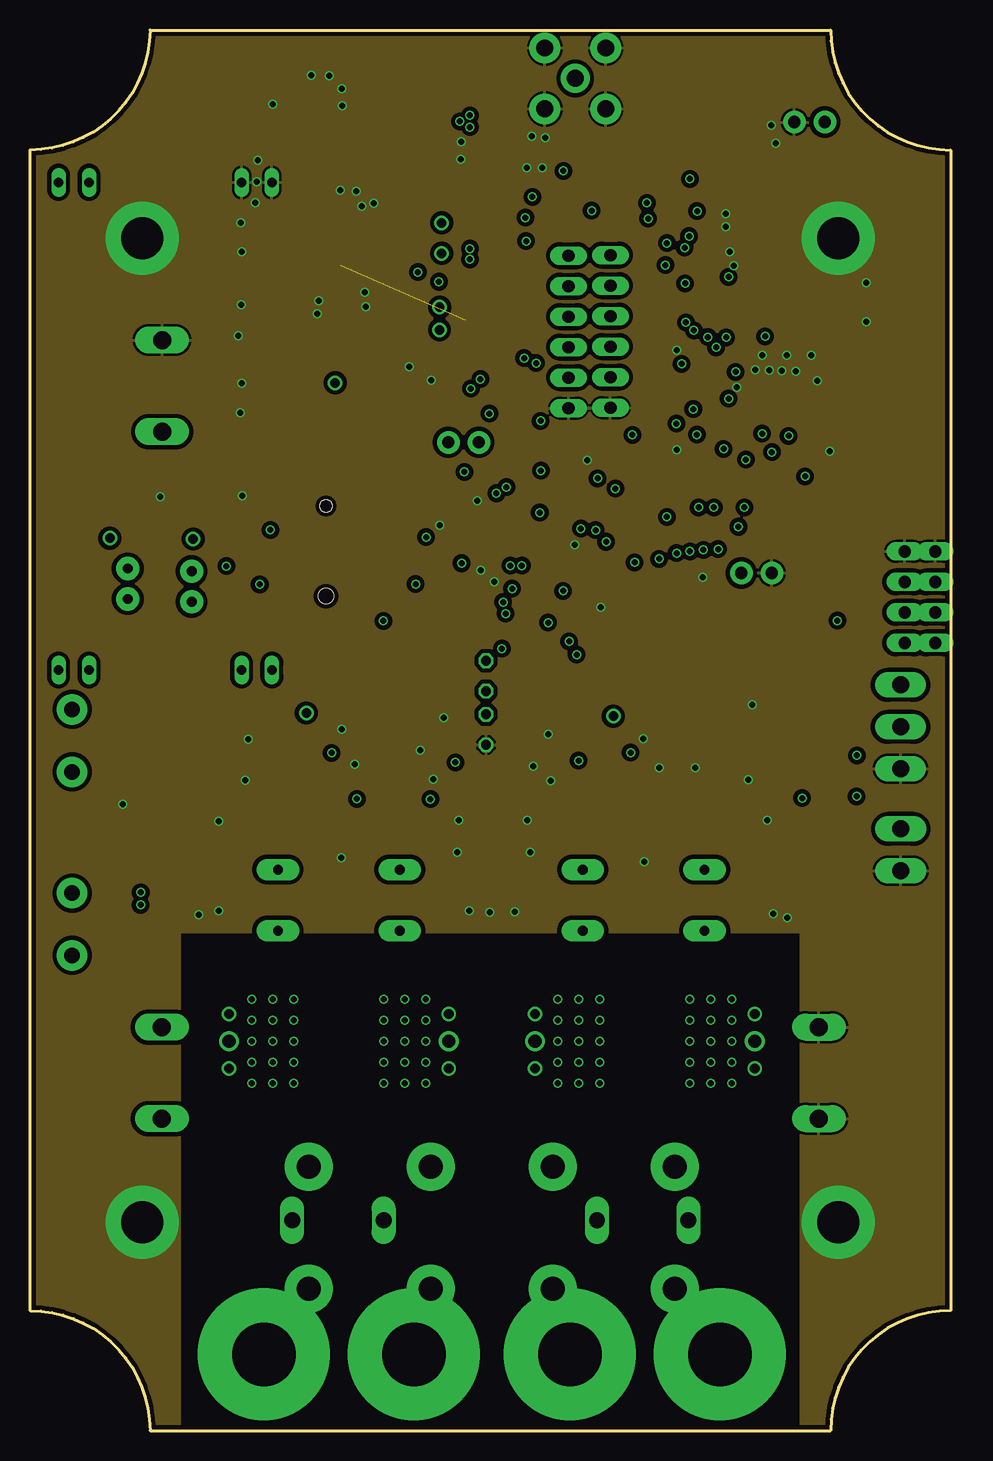
[diagram p3: board, inner layer GND]
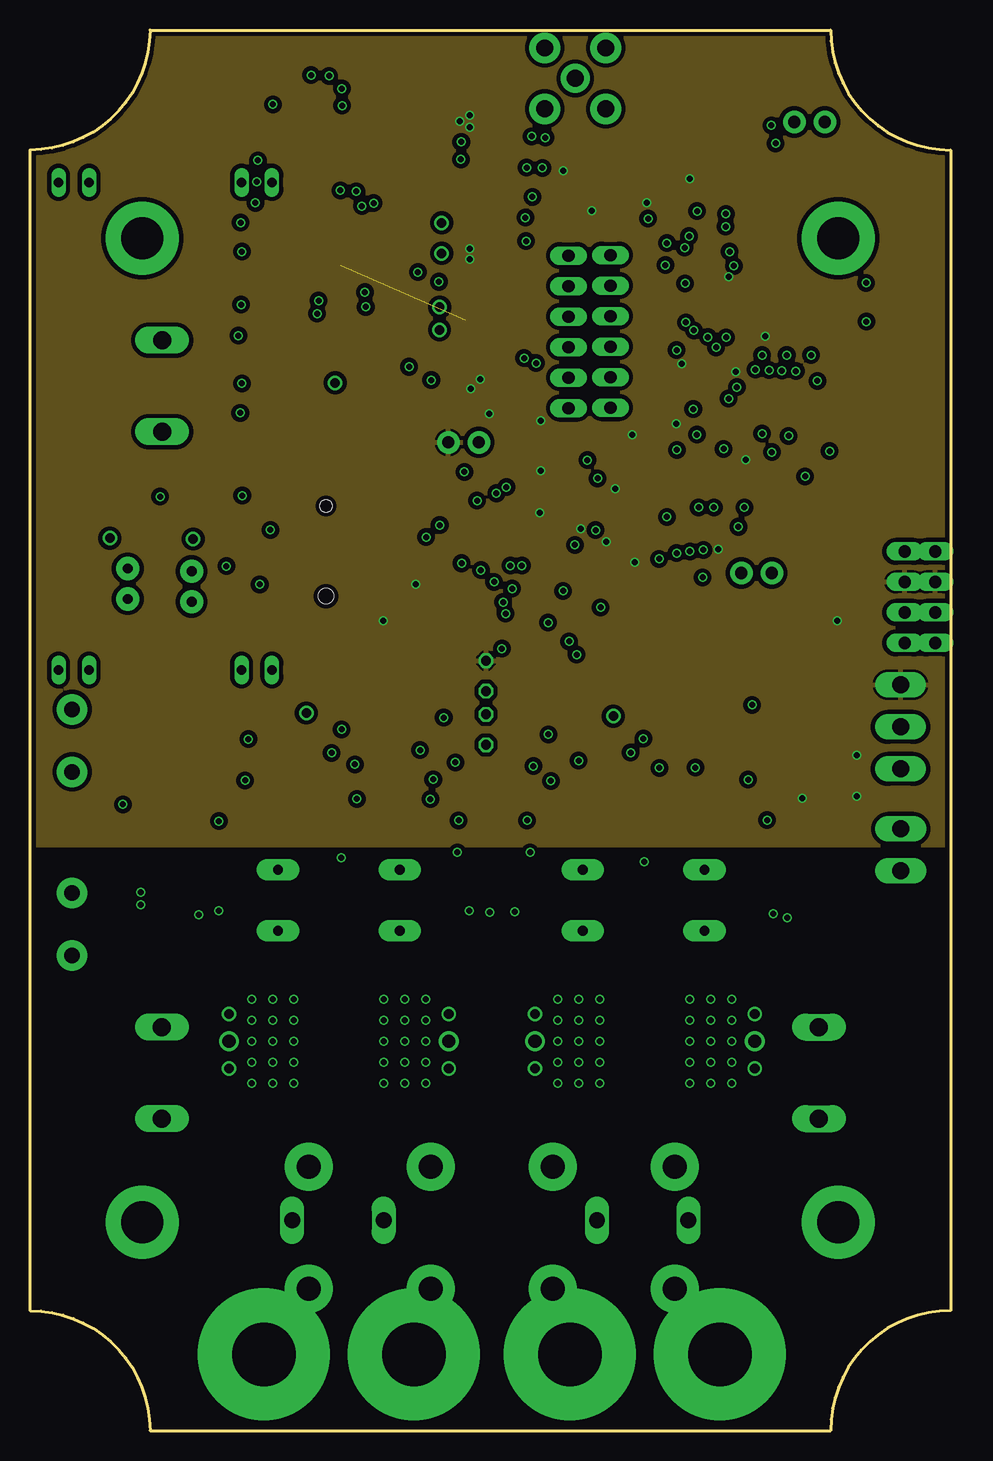
[diagram p4: board, inner layer +3V3]
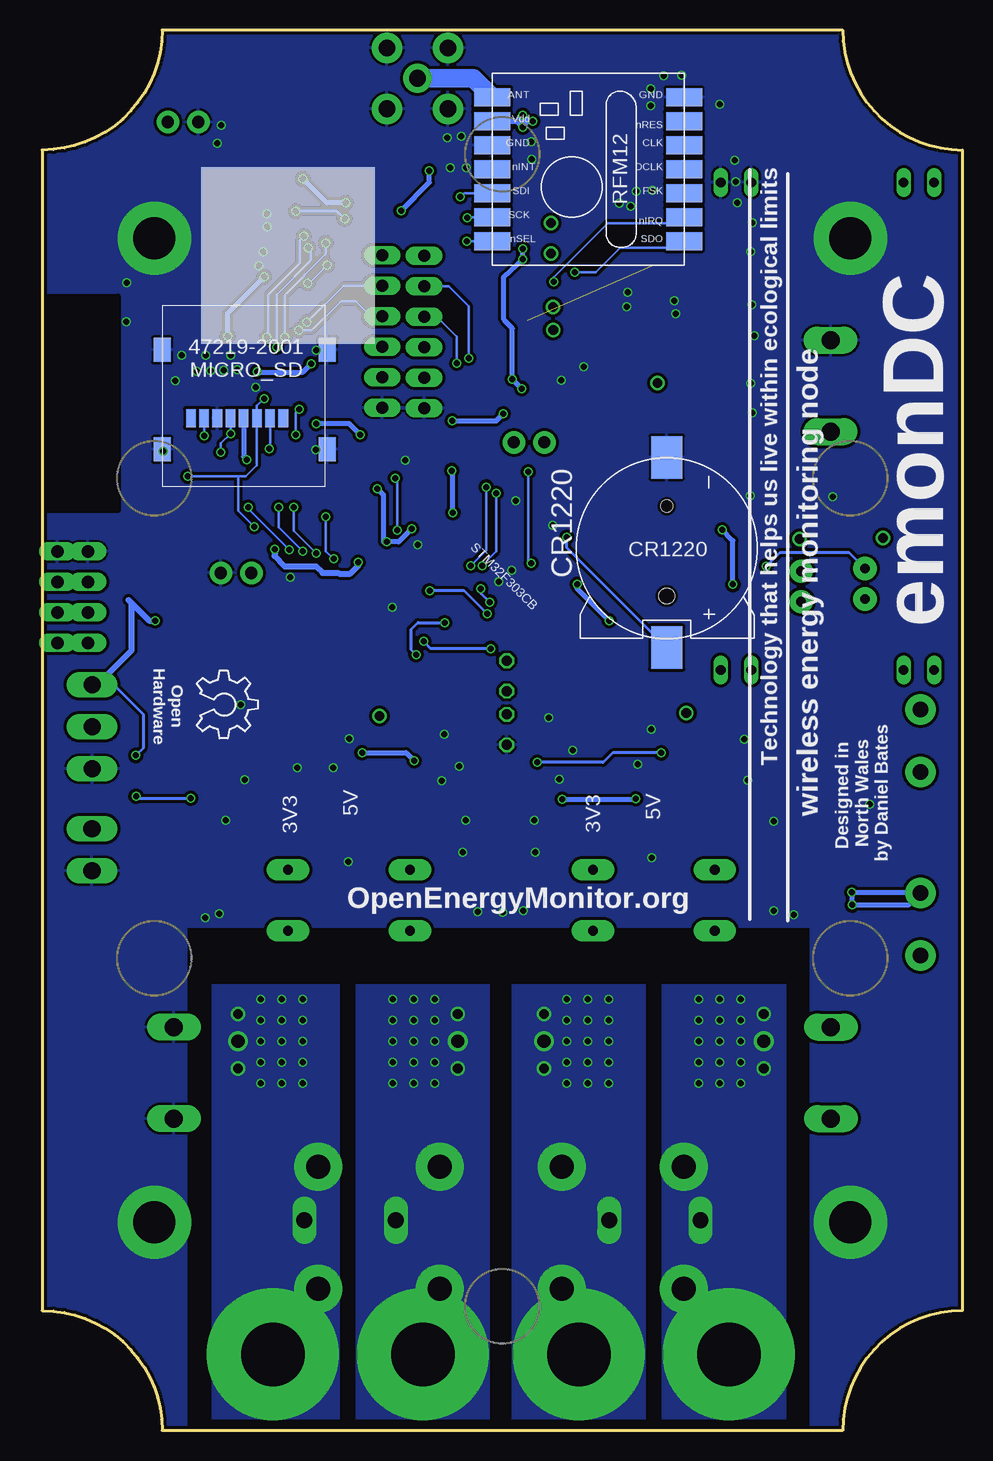
[diagram p5: board, bottom side, seen from below]

Size 76.71 x 116.71 mm. Coordinates in mm from the lower left corner, seen from the top.
Outline: 10,0 66.71,0 arc-90 76.71,10 76.71,106.71 arc-90 66.71,116.71 10,116.71 arc-90 0,106.71 0,10 arc-90 10,0
Copper layers (1*16): Top 0.035mm / dielectric 0.2mm / Bottom 0.035mm
Design rules "jlcpcb *": minimum track width 6mil, minimum drill 0.35mm, track to track 7mil, track to pad 7mil, pad to pad 7mil, via to via 0.2mm, smd to smd 2mil, copper to edge 10mil, drill to drill 10mil, minimum pad ring 3mil, minimum via ring 3mil, stop-mask expansion 2mil, vias tented up to drill 25mil, thermal gap 8mil
tRestrict: area 70.5,76.6 to 78.1,94.4
bRestrict: area 70.4,76.7 to 78,94.5

### Footprints (pad centres in the part's own frame; a part is rotated, then mirrored left to right if it is on the bottom)
SMT-JUMPER_2_NC_TRACE_NO-SILK = smd 0.635 x 1.27: 1 -0.508,0; 2 0.508,0
C1206 = smd 1.6 x 1.8: 1 -1.4,0; 2 1.4,0
C0603 = smd 1.1 x 1: 1 -0.85,0; 2 0.85,0
C0805 = smd 1.3 x 1.5: 1 -0.95,0; 2 0.95,0
CAPAE530X610N = smd 2.87 x 0.762: 1 -1.981,0; 2 1.981,0
CR1220SMD = smd 3.54 x 2.6: P+ 8.3,0; P- -7.55,0 | hole 1: -3.5,0 | hole 1.3: 4,0
DO214AA = smd 1.8 x 2.2: A 2.55,0; C -2.55,0
SMB = smd 2.4 x 2.4: A 2.2,0; C -2.2,0
SODFL1608X70N = smd 0.64 x 0.42: 1 -0.75,0; 2 0.75,0
SOD123F = smd 1.34 x 1.8: A 1.43,0; C -1.43,0
EBW_SERIES_15.2MM = smd 5.2 x 8.75: P$1 -5.4,0; P$2 5.4,0 | drill 0.5: P$3 -3.75,3.5; P$4 -3.75,1.75; P$5 -3.75,0; P$6 -3.75,-1.75; P$7 -3.75,-3.5; P$8 -5.5,3.5; P$9 -5.5,1.75; P$10 -5.5,0; P$11 -5.5,-1.75; P$12 -5.5,-3.5; P$13 -7.25,3.5; P$14 -7.25,1.75; P$15 -7.25,0; P$16 -7.25,-1.75; P$17 -7.25,-3.5; P$18 7.25,1.75; P$19 7.25,3.5; P$20 7.25,0; P$21 7.25,-1.75; P$22 7.25,-3.5; P$23 5.5,3.5; P$24 5.5,1.75; P$25 5.5,0; P$26 5.5,-1.75; P$27 5.5,-3.5; P$28 3.75,3.5; P$29 3.75,1.75; P$30 3.75,0; P$31 3.75,-1.75; P$32 3.75,-3.5 | drill 0.8: P$33 -9.155,2.258; P$35 -9.155,-2.258; P$36 9.155,2.258; P$38 9.155,-2.258 | drill 1.1: P$34 -9.155,0; P$37 9.155,0
1X02 = drill 1.016 pad 1.88: 1 0,0; 2 2.54,0
445/030_SERIES_LITTELFUSE = drill 1.3 pad 2.54: P$1 -10.25,0; P$2 -5.05,0; P$3 10.25,0; P$4 5.05,0
TR5 = drill 0.813 pad 1.778 long: 1 -2.54,0; 2 2.54,0
BEADC1608X95N = smd 0.9 x 0.97: 1 -0.785,0 | smd 0.933 x 0.97: 2 0.769,0
R0603 = smd 1 x 1.1: 1 -0.85,0; 2 0.85,0
SOIC127P600X175-8N = smd 1.528 x 0.65: 1 -2.711,1.905; 2 -2.711,0.635; 3 -2.711,-0.635; 4 -2.711,-1.905; 5 2.711,-1.905; 6 2.711,-0.635; 7 2.711,0.635; 8 2.711,1.905
CHIPLED_1206 = smd 1.5 x 1.5: A 0,-1.496; C 0,1.496
5,3//11-PAD = drill 5.3 pad 11: B5,5 0,0
47219-2001_MICROSD = smd 1.45 x 2: P$1 0,0; P$2 13.75,0; P$3 0,8.3; P$4 13.75,8.3 | smd 0.8 x 1.5: PIN1 10.08,2.6; PIN2 8.98,2.6; PIN3 7.88,2.6; PIN4 6.78,2.6; PIN5 5.68,2.6; PIN6 4.58,2.6; PIN7 3.48,2.6; PIN8 2.38,2.6
2/10,16 = drill 2 pad 4: P$1 -5.08,0; P$2 -5.08,10.16; P$3 5.08,0; P$4 5.08,10.16
0207/2V = drill 0.813 pad 1.93: 1 -1.27,0; 2 1.27,0
0207/2V' = drill 0.813 octagon: 1 -1.27,0; 2 1.27,0
SOT223 = smd 1.499 x 2.007: 1 -2.261,-3.15; 2 0.025,-3.15; 3 2.311,-3.15 | smd 3.81 x 2.007: 4 0,3.15
SJ = smd 1.168 x 1.6: 1 -0.762,0; 2 0.762,0
SJ_2 = smd 1.168 x 1.6: 1 -1.524,0; 2 0,0; 3 1.524,0
518144001 = drill 1.4 pad 2.4: 1 0,0 | drill 1.4 pad 2.55: 2 -2.54,2.54; 3 -2.54,-2.54; 4 2.54,-2.54; 5 2.54,2.54
STM32F303CB_LQFP48-7X7MM = smd 1.194 x 0.305: 1 -4.25,2.75; 2 -4.25,2.25; 3 -4.25,1.75; 4 -4.25,1.25; 5 -4.25,0.75; 6 -4.25,0.25; 7 -4.25,-0.25; 8 -4.25,-0.75; 9 -4.25,-1.25; 10 -4.25,-1.75; 11 -4.25,-2.25; 12 -4.25,-2.75; 25 4.25,-2.75; 26 4.25,-2.25; 27 4.25,-1.75; 28 4.25,-1.25; 29 4.25,-0.75; 30 4.25,-0.25; 31 4.25,0.25; 32 4.25,0.75; 33 4.25,1.25; 34 4.25,1.75; 35 4.25,2.25; 36 4.25,2.75 | smd 0.305 x 1.194: 13 -2.75,-4.25; 14 -2.25,-4.25; 15 -1.75,-4.25; 16 -1.25,-4.25; 17 -0.75,-4.25; 18 -0.25,-4.25; 19 0.25,-4.25; 20 0.75,-4.25; 21 1.25,-4.25; 22 1.75,-4.25; 23 2.25,-4.25; 24 2.75,-4.25; 37 2.75,4.25; 38 2.25,4.25; 39 1.75,4.25; 40 1.25,4.25; 41 0.75,4.25; 42 0.25,4.25; 43 -0.25,4.25; 44 -0.75,4.25; 45 -1.25,4.25; 46 -1.75,4.25; 47 -2.25,4.25; 48 -2.75,4.25
MA04-1 = drill 1.016 long: 1 -3.81,0; 2 -1.27,0; 3 1.27,0; 4 3.81,0
P1-13Y = drill 1.321 pad 1.905 long: TP 0,0
MODULE_ESP32-WROOM-32D = smd 2 x 0.9: 1 -8.5,5.26; 2 -8.5,3.99; 3 -8.5,2.72; 4 -8.5,1.45; 5 -8.5,0.18; 6 -8.5,-1.09; 7 -8.5,-2.36; 8 -8.5,-3.63; 9 -8.5,-4.9; 10 -8.5,-6.17; 11 -8.5,-7.44; 12 -8.5,-8.71; 13 -8.5,-9.98; 14 -8.5,-11.25; 25 8.5,-11.25; 26 8.5,-9.98; 27 8.5,-8.71; 28 8.5,-7.44; 29 8.5,-6.17; 30 8.5,-4.9; 31 8.5,-3.63; 32 8.5,-2.36; 33 8.5,-1.09; 34 8.5,0.18; 35 8.5,1.45; 36 8.5,2.72; 37 8.5,3.99; 38 8.5,5.26 | smd 0.9 x 2: 15 -5.715,-12.25; 16 -4.445,-12.25; 17 -3.175,-12.25; 18 -1.905,-12.25; 19 -0.635,-12.25; 20 0.635,-12.25; 21 1.905,-12.25; 22 3.175,-12.25; 23 4.445,-12.25; 24 5.715,-12.25 | smd 5 x 5: 39 -1,-2.24
TP0.8 = drill 0.8: P$1 0,0
TP0.8_X2 = drill 0.8 long: P$1 0,0; P$2 0,2.54
RFM12 = smd 1.5 x 3: 1 -5,-10; 2 -3,-10; 3 -1,-10; 4 1,-10; 5 3,-10; 6 5,-10; 7 7,-10; 8 7,6; 9 5,6; 10 3,6; 11 1,6; 12 -1,6; 13 -3,6; 14 -5,6
7.62MM = drill 1.5 long: P$1 0,-3.81; P$2 0,3.81
TP3.5 = drill 3.5 pad 6.096: P$1 0,0
MA06-1 = drill 1.016 long: 1 0,0; 2 2.54,0; 3 5.08,0; 4 7.62,0; 5 10.16,0; 6 12.7,0
180-3 = drill 1.422 long: 1 -3.5,0; 2 0,0; 3 3.5,0
180-2 = drill 1.422 long: 1 -1.75,0; 2 1.75,0
CRYSTAL_8X3.8 = smd 1.3 x 1.9: P$1 -2.75,-1.6; P$2 2.75,-1.6; P$3 2.75,1.6; P$4 -2.75,1.6

### Placement (x,y rotation side)
3V3  36.15,99.46 0 top
5V  35.76,92.51 0 top
C1  19.49,54.2 180 top
C2  45.36,68.39 0 top
C3  32.17,54.33 0 top
C4  44.68,54.2 180 top
C5  60.66,98.7 180 top
C6  58.39,54.23 0 top
C7  19.72,56.39 180 top
C8  44.2,56.88 180 top
C9  32.48,76.92 270 top
C10  46.44,59.12 90 top
C11  60.65,100.85 180 top
C12  59.28,59.39 0 top
C13  20.89,59.11 90 top
C14  33.62,58.34 0 top
C15  41.55,65.09 180 top
C16  35.36,77.3 0 top
C17  60.7,96.8 180 top
C18  26.06,61.08 0 top
C19  52.14,61.04 0 top
C20  15.84,76.53 0 top
C21  9.12,76.58 0 top
C22  19.49,86.05 180 top
C23  19.49,92.57 180 top
C24  19.49,99.34 180 top
C25  67.59,48.59 270 top
C26  31.17,71.15 90 top
C27  44.32,74.51 270 top
C28  38.63,106.27 0 top
C29  38.62,103.99 0 top
C30  23.91,67.34 0 top
C31  48.62,66.88 180 top
C35  47.27,82.12 180 top
CR1220  24.67,73.54 270 bottom
D1  7.78,54.81 270 top
D2  18.09,50.81 180 top
D3  33.36,50.91 0 top
D4  43.59,50.88 180 top
D5  59.1,50.88 0 top
D6  21.41,73.57 90 top
D7  30.82,87.24 0 top
D9  21.42,70.84 270 top
EBW_A  51.24,32.44 180 top
EBW_B  25.74,32.44 180 top
ESPBOOT  61.82,71.46 180 top
F1  3.51,49.84 90 top
F2  20.66,44.2 90 top
F3  30.82,44.2 90 top
F4  46.06,44.2 90 top
F5  56.22,44.2 90 top
FB1  39.13,90.49 0 top
FB12  18.24,81.55 180 top
IC3  51.31,55.88 180 top
IC4  25.78,56.13 180 top
LED1  28.85,114.3 90 top
LED2  53.06,71.1 270 top
LOGO1  63.83,63.34 270 bottom
MH1  31.99,6.35 90 top
MH2  19.49,6.35 90 top
MH3  57.49,6.35 90 top
MH4  44.99,6.35 90 top
MICRO_SD  66.71,81.76 0 bottom
MOUNT_10.16_A  28.32,11.81 0 top
MOUNT_10.16_B  48.64,11.81 0 top
R1  8.14,70.56 90 top
R2  9.08,74.24 180 top
R3  13.47,70.33 90 top
R4  15.84,74.32 180 top
R5  33.28,110.74 270 top
R6  31.03,57.79 90 top
R7  56.57,57.26 90 top
R8  67.62,56.86 270 top
R9  48.53,70.92 180 top
R10  9.44,65.1 90 top
R11  [0207/2V']  38,62.88 90 top
R12  23.24,50.68 90 top
R13  [0207/2V']  38,58.41 90 top
R14  40.14,62.49 90 top
R15  40.14,58.18 90 top
R18  48.32,100.99 270 top
R19  23.27,62.59 270 top
R20  50.01,78.15 90 top
R22  23.87,65.19 0 top
R24  48.61,61.99 270 top
R25  48.62,64.75 180 top
R26  59.28,61.59 180 top
R27  33.57,60.55 180 top
R28  52.15,63.24 180 top
R29  26.06,63.29 180 top
R30  12.7,65.11 90 top
R31  28.32,50.44 90 top
R36  48.5,50.45 90 top
R37  54.06,50.45 90 top
R41  66.76,51.43 180 top
REG1_5V  29.06,91.84 270 top
REG2_3.3  29.06,99.38 270 top
RESET  63.7,109.04 0 top
SJ1  15.63,40.96 90 top
SJ3  36.62,40.98 270 top
SJ6  61.73,40.53 90 top
SJ13  32.68,113.68 180 top
SJ14  40.32,40.98 90 top
SJ15  9.22,46.71 180 top
SJ29  61.56,103.97 90 top
SMA  45.44,112.68 0 top
STM32F303CB  38.25,71.17 0 top
STMBOOT  37.4,82.34 180 top
SV1  72.9,69.44 90 top
SV2  75.44,69.44 90 top
TP8  54.87,17.53 180 top
TP9  47.25,17.53 180 top
TP10  29.47,17.53 180 top
TP11  21.85,17.53 0 top
U1  64.44,85.44 270 top
U$1  6.66,74.36 90 top
U$2  4.93,63.37 90 top
U$3  20.17,104.01 90 top
U$4  13.59,74.3 90 top
U$5  48.61,59.53 90 top
U$6  23.04,59.79 90 top
U$7  34.13,91.72 90 top
U$8  34.29,100.64 90 top
U$9  25.42,87.31 90 top
U$10  4.93,104.01 90 top
U$11  20.17,63.37 90 top
U$14  33.22,104.11 90 bottom
U$15  11,29.81 0 top
U$16  65.73,29.81 180 top
U$17  11.01,87.06 0 top
U$18  34.13,93.62 90 top
U$19  34.29,98.1 90 top
U$22  67.36,17.36 90 top
U$23  67.36,99.36 90 top
U$24  9.36,17.36 90 top
U$25  9.36,99.36 90 top
U$26  20.53,112.58 0 top
UART(ESP)  48.37,97.94 270 top
UART/STM  44.88,97.9 270 top
X1  72.55,58.63 90 top
X2  72.56,48.39 90 top
Y1  28.33,77.63 90 top

### Tracks (layer width: path | path; a pad name or v marks a point on that pad's centre or on a via)
3.3V_
  Top 0.406: REG2_3.3.4 25.94,99.38 REG2_3.3.2 25.9,99.34 C24.1 | REG2_3.3.4 33.84,99.38 | REG2_3.3.4 33.92,99.38 | 33.92,99.38 35.56,99.38 3V3.1 | U$8.P$1 U$19.P$1 34.3,99.01 33.92,99.38
5V_
  Top 0.406: FB12.1 20.37,81.55 24.36,85.54 27.69,85.54 D7.C 29.39,91.81 | 29.39,91.81 REG1_5V.2 22.23,91.81 C23.1 | 29.39,91.81 32.19,91.81 REG1_5V.4 34.02,91.84 U$7.P$1 34.13,92.56 | 34.13,92.56 U$18.P$1 | 5V.1 34.17,92.51 34.13,92.56
  Top 0.508: C23.1 21.47,93.04 25.41,96.97
6.5V
  Top 0.508: U$10.P$2 3.73,104.01 | 3.73,104.01 U$10.P$1 | 3.73,104.01 3.73,90.91 7.29,87.35 14.52,87.35 16.11,88.94 23.04,88.94 | 23.04,88.94 23.04,87.62 C22.1 | 23.04,88.94 25.33,88.94 REG1_5V.3 25.42,89.03 U$9.P$1
+3V3  (via drill 0.5)
  Top 0.254: 42.4,64.76 C15.1 41,66.49 STM32F303CB.24 | C26.1 31.56,69.92 31.72,69.92 STM32F303CB.9 | STM32F303CB.36 42.87,73.92 C27.1 | STM32F303CB.48 35.5,76.32 C16.1 | v68.9,56.25 67.86,56.25 R8.2 68.89,54.74 v68.89,52.85 | v64.34,52.7 64.65,52.7 R41.2
  Top 0.406: v36.66,108.62 v36.66,109.59 36.16,109.09 v35.83,109.09 | v36.66,108.62 37.68,107.6 C28.1 C29.1 37.67,100.48 3V3.2 v36.65,98.5 v36.66,97.6 | v36.66,108.62 36.19,109.09 | 36.19,109.09 v35.83,109.09 | v35.83,109.09 34.08,109.09 R5.2 | v59.66,80.91 59.66,81.05 56.81,83.9 v53.87,83.9 54.31,84.34 v54.31,88.88 | C26.1 29.45,70.3 26.25,73.5 25,73.5 24.22,74.28 24.22,75.05 27.04,77.87 C9.1 33.95,77.87 C16.1 34.51,81.99 STMBOOT.2 34.86,84.95 v36.75,86.83 | v36.75,86.83 v37.52,87.61 | v45.91,75.16 45.71,75.36 C27.1 43.61,75.36 v42.48,76.49 | v48.78,78.5 49.28,79 R20.2 | R20.2 48.12,80.89 C35.1 49.33,82.12 v50.19,82.98 50.01,82.8 R20.2 | v46.81,101.66 46.98,101.84 R18.1 50.95,101.84 v51.41,102.3 | v44.45,104.96 42.95,106.46 41.81,106.46 39.18,109.09 36.19,109.09 | v54.99,104.3 55.42,104.73 56.02,104.73 | 56.02,104.73 SJ29.2 | v58.21,96.14 56.69,97.67 56.69,104.06 56.02,104.73 | v58.8,88.22 58.8,89.45 60.53,91.19 v61.27,91.19 | v29.44,67.48 32.77,64.15 R11.2 39.33,64.15 R14.2 40.99,63.34 42.4,64.76 | v32.13,70.53 31.72,70.12 31.72,69.92 | v42.58,80 42.58,84.12 v42.56,84.14 | v38.28,84.74 36.75,86.27 v36.75,86.83
  Top 0.508: v67.27,67.49 63.79,70.98 63.79,71.77 61.96,73.6 57.43,73.6 57.35,73.52 v57.35,73.45 | v50.39,72.35 49.73,72.35 v48.01,74.06
  Bottom 0.254: X1.3 70.73,62.13 68.31,59.71 68.31,56.85 v68.9,56.25 | v68.89,52.85 68.74,52.7 v64.34,52.7
  Bottom 0.406: v36.66,109.59 37.14,109.11 U$14.9 37.15,109.11 v36.66,108.62 | v36.66,108.62 36.19,109.09 v35.83,109.09 36.16,109.09 v36.66,109.59 | v36.66,108.62 v36.66,109.59 | MICRO_SD.PIN4 59.92,81.17 v59.66,80.91 | v50.19,82.98 51.12,83.9 v53.87,83.9 | 38.16,92.48 37.52,91.84 v37.52,87.61 v36.75,86.83 | 38.14,92.47 38.24,92.57 38.24,96.16 v36.66,97.6 v36.65,98.5 | v45.91,75.16 47.01,74.06 v48.01,74.06 48.28,74.06 48.28,77.99 v48.78,78.5 | v46.81,101.66 44.45,104.02 v44.45,104.96 | v51.41,102.3 53,102.3 v54.99,104.3 | v58.8,88.22 58.76,88.19 55,88.19 v54.31,88.88 | v61.27,91.19 61.27,93.09 v58.21,96.14 | v29.44,67.48 32.13,70.17 v32.13,70.53 | v42.48,76.49 42.48,79.9 v42.58,80 | v42.56,84.14 38.88,84.14 v38.28,84.74
  Bottom 0.508: X1.3 72.13,62.13 69.25,65.01 69.25,68.95 | 69.5,69.2 69.25,68.95 | 69.25,68.95 67.8,67.49 v67.27,67.49 | v57.35,73.45 57.35,72.89 56.48,72.02 53.9,72.02 53.34,71.46 52.05,71.46 52,71.41 51.03,71.41 50.38,72.06 50.38,72.34 v50.39,72.35
  pour +3V3 (isolate 0.356): -10.92,48.76 -10.92,126.25 84.33,126.25 84.33,48.76
+3V3_ESP
  Top 0.508: U1.2 68.43,95.23 67.88,95.78 62.57,95.78 C17.1 61.48,96.87 61.48,98.57 C5.1 61.6,98.71 C11.1 61.6,103.16 SJ29.1
+5V  (via drill 0.5)  (1 unrouted)
  Top 0.406: 5V.2 36.32,92.51 FB1.1 38.2,90.48 32.21,84.49 27.06,84.49 20.03,77.47 v20.03,75.05 | C10.1 46.44,57.71 47.64,56.52 IC3.6 50.04,56.52 v50.06,56.5 | v45.71,55.83 42.68,55.83 42.35,56.16 41.5,56.16 40.16,54.83 40.16,53.86 39.77,53.47 35.51,53.47 34.66,52.62 v33.36,52.62 | v27.23,52.65 26.03,53.85 26.03,57.15 25.66,57.52 24.55,57.52 23.8,56.77 IC4.6 22.26,56.77 20.89,58.14 C13.1 19.84,58.26 18.09,60.02 17.26,60.02 15.15,62.12 15.15,65.9 19.14,69.89 v19.14,70.5
  Bottom 0.406: v50.06,56.5 46.38,56.5 v45.71,55.83 | v33.36,52.62 27.26,52.62 v27.23,52.65 | v19.14,70.5 19.14,74.17 v20.03,75.05
+5V_EXT
  Top 0.406: FB1.2 44.68,90.48 UART/STM.4 45.04,90.44 48.26,90.44 UART(ESP).4
+5V_EXT2
  Top 0.406: U$17.P$1 12.71,81.55 FB12.2
ADCSHUNT_OUT_A
  Top 0.254: R19.1 23.02,63.69 R22.1 23.02,67.29 C30.1 24.05,68.32 30.81,68.32 33.55,65.58 35.54,65.58 36,66.04 STM32F303CB.14
ADCSHUNT_OUT_A_
  Top 0.254: IC4.5 23.07,59.76 U$6.P$1 23.04,61.51 R19.2 25.2,61.74 25.22,61.73 C18.1 R29.2
ADCSHUNT_OUT_B  (via drill 0.5)
  Top 0.254: R24.1 49.47,63.7 R25.1 C31.1 48.43,65.84 45.01,65.84 v44.93,65.76 | v39.33,65.17 37.24,65.17 36.5,65.91 STM32F303CB.15
  Bottom 0.254: v44.93,65.76 44.35,65.18 39.35,65.18 v39.33,65.17
ADCSHUNT_OUT_B_
  Top 0.254: IC3.5 48.6,59.52 U$5.P$1 R24.2 51.19,61.15 C19.1 51.29,63.23 R28.2
ANT
  Bottom 1.524: U$14.8 40.78,112.68 SMA.1
BOOT_STM
  Top 0.254: STMBOOT.1 35.36,80.3 35.36,79.23 35.97,78.62 37.67,78.62 38.02,78.26 38.02,76.82 37.5,76.29 STM32F303CB.44
D0/RX  (via drill 0.5)
  Top 0.203: U1.35 65.89,77.79 65.3,78.38 64.52,78.38 64.19,78.7 64.19,78.72 63.36,79.56 63.36,79.74 68.11,84.49 68.11,89.77 65.53,92.35 v54.66,92.35
  Bottom 0.203: v54.66,92.35 51.6,95.4 UART(ESP).2
D1/TX  (via drill 0.5)
  Top 0.203: U1.34 64.62,77.67 63.73,78.55 63.73,78.65 62.98,79.4 62.98,79.9 67.72,84.64 67.72,89.61 65.43,91.91 55.56,91.91 v55.33,91.67
  Bottom 0.203: v55.33,91.67 54.23,91.67 51.78,94.12 50.59,94.12 49.33,92.86 UART(ESP).3
DS18B20  (via drill 0.5)
  Top 0.254: R8.1 68.54,58.63 X1.2 68.7,58.63 57.37,69.97 v44.43,69.97 | STM32F303CB.21 39.5,67.93 v39.63,68.07
  Bottom 0.254: v39.63,68.07 41.53,69.97 v44.43,69.97
ESP_RST  (via drill 0.5)
  Top 0.203: v55.6,101.62 55.9,101.31 55.9,97.12 57.8,95.22 67.04,95.22 67.18,95.08 67.18,93.96 U1.3
  Top 0.254: U1.3 67.16,92.67 68.26,91.57 70.3,91.57 70.72,91.99 70.72,96.55 71.83,97.66 71.83,103.8 66.59,109.04 RESET.2 | R18.2 48.32,98 UART(ESP).1 51.42,100.99 v51.52,100.99
  Bottom 0.254: v51.52,100.99 52.14,101.62 v55.6,101.62
GND  (via drill 0.5)
  Top 0.203: STM32F303CB.8 37.37,70.42 38.13,71.18 | 38.13,71.18 37.62,71.7 | 37.62,71.7 v37.57,71.7 | STM32F303CB.35 40.37,73.42 38.13,71.18 | 38.13,71.18 38.59,70.72 v38.68,70.72 40.5,68.91 STM32F303CB.23 | STM32F303CB.47 36,73.31 37.62,71.7
  Top 0.254: C15.2 40.5,65.29 STM32F303CB.23 | C26.2 31.78,72 32.87,70.9 32.87,70.68 33.13,70.42 STM32F303CB.8 | C27.2 44.07,73.42 STM32F303CB.35 | C16.2 36,77.09 STM32F303CB.47
  other vias: 27.08,55.51 33.6,54.26 17.93,54.17 18.19,57.62 32.51,56.71 41.95,55.38 43.42,54.13 59.84,54.24 61.43,50.87 41.42,50.84 35.72,50.84 15.75,50.78 7.73,52.18 34.48,59.41 60.17,60.48 47.55,68.6 56.04,71.09 62.67,88.33 60.44,88.42 61.59,88.37 63.06,89.61 61,89.61 58.9,86.95 65.61,87.47 63.82,88.28 65.09,89.62 27.66,102.04 28.64,102.28 27.98,93.63 25.87,103.35 27.19,103.27 27.91,94.86 24.06,94.15 23.93,93.08 17.59,93.82 17.36,91.23 17.66,87.26 17.52,84.81 17.54,100.66 17.66,98.23 33.44,87.54 31.6,88.65 34.15,75.46 37.27,77.5 45.41,73.81 52.45,55.22 55.46,55.24 61.94,43.06 63.1,42.75 40.41,43.25 38.33,43.19 36.61,43.3 15.74,43.33 14.08,42.99 17.69,77.91 10.83,77.83 18.78,102.29 18.99,105.85 18.9,104.05 25.96,58.43 51.12,57.66 35.61,48.18 41.68,48.18 25.92,47.74 51.2,47.41 25.99,111.83 26,110.42 20.25,110.5 23.43,112.96 24.92,112.89 41.8,107.85 42.95,107.74 41.38,105.24 42.69,105.23 35.94,107.39 35.91,105.92 69.69,92.41 69.68,95.64 66.63,81.62 53.92,81.72 53.88,90.03 57.99,101.39 57.97,100.33 58.3,98.23 58.65,97.06 61.78,108.77 62.13,107.26 43.19,58.02 46.45,80.87
  pour Bottom (isolate 0.254, rank 3): -3.82,-5.59 12.6,-5.59 12.6,41.97 64.75,41.97 64.75,-4.8 84.08,-4.8 84.08,125.18 -3.82,128.78
  pour Top (isolate 0.203, rank 3): -2.03,-3.52 12.47,-3.52 12.47,41.57 64.25,41.57 64.25,-4.27 80.27,-4.27 80.27,105.02 59.89,123.54 13.27,123.54 -2.03,109.64
  pour GND (isolate 0.356, rank 3): -2.03,-0.69 12.47,-0.69 12.47,41.57 64.25,41.57 64.25,-1.63 80.27,-1.63 80.27,105.02 61.21,122.34 11.94,122.34 -2.03,109.64
LED_STM
  Top 0.254: STM32F303CB.29 43.84,70.42 44.1,70.67 47.43,70.67 R9.2
LOAD_A
  Top 0.254: F3.1 30.82,32.45 31.41,31.85 32.25,32.69 29.74,32.69 EBW_B.P$5
  Top 0.508: EBW_B.P$1 31.14,34.73 SJ3.2
  pour Top (no thermals): 26.49,0.35 26.49,39.62 37.49,39.62 37.49,0.35
  pour Bottom (isolate 0.813, no thermals): 26.49,37.16 26.49,0.35 37.49,0.35 37.49,37.16
LOAD_B
  Top 0.254: EBW_A.P$1 56.22,32.86 F5.1
  Top 0.508: EBW_A.P$1 56.64,34.67 SJ6.1
  pour Top (no thermals): 51.99,0.35 51.99,39.61 62.54,39.61 62.54,0.35
  pour Bottom (isolate 0.813, no thermals): 51.99,37.16 51.99,0.35 62.48,0.35 62.48,37.16
LOAD_B_T
  Top 0.254: C6.1 56.73,53.98 IC3.1 54.06,53.94 R37.2
LOAD_T_A
  Top 0.508: IC4.1 28.49,51.47 R31.2 30.77,53.74 C3.1
N$3
  Top 0.254: IC4.4 29.09,58.64 R6.2 32.47,58.64 C14.1 32.72,58.39 R27.2
N$4
  Top 0.254: R29.1 C18.2 26.91,57.2 27.35,56.77 IC4.3 28.66,56.94 R6.1
N$5
  Top 0.254: SJ13.1 33.28,113.58 R5.1
N$6
  Top 0.254: LED1.A 31.54,114.3 SJ13.2
N$10  (via drill 0.5)
  Top 0.406: SJ15.2 v9.22,44.84 v9.23,44.84 9.21,44.82 v9.21,43.8
  Top 1.778: F1.P$1 F1.P$2
  Bottom 0.406: v9.23,44.84 9.23,43.81 v9.21,43.8 4.5,43.8 F1.P$2 3.58,44.85 9.21,44.85 v9.23,44.84
N$11
  Top 0.254: R30.2 12.7,68.29 R3.1
N$24
  Top 0.254: R1.1 9.44,67.99 R10.2
N$25
  Top 0.254: R28.1 52.99,63.23 C19.2 52.99,59.06 52.4,58.46 52.4,57.11 53,56.52 IC3.3 56.46,56.52 R7.1
N$27
  Top 0.254: IC3.4 56.25,57.78 R7.2 57.15,58.11 C12.1 R26.2
N$28  (via drill 0.5)
  Top 0.203: R20.1 52.83,77.3 U1.25 53.19,76.24 v53.08,76.14 | v52.43,72.64 52.76,72.32 58.42,72.32 ESPBOOT.2
  Bottom 0.203: v53.08,76.14 53.08,73.29 v52.43,72.64
N$31
  Top 0.254: LED2.A 51.38,70.92 R9.1
N$33
  Top 0.508: R12.1 20.66,47.25 F2.2 20.66,50.44 D2.C
N$34
  Top 0.508: R31.1 30.82,47.09 F3.2 30.82,50.56 D3.C
N$35
  Top 0.254: F4.2 48.49,49.17 R36.1
  Top 0.508: D4.C 46.06,50.61 F4.2
N$38
  Top 0.254: R37.1 54.06,48.89 F5.2
  Top 0.508: D5.C 56.22,50.2 F5.2
OSC32_IN
  Top 0.254: Y1.P$1 31.03,73.79 32.19,73.79 33.06,72.92 STM32F303CB.3
OSC32_OUT
  Top 0.254: STM32F303CB.4 32.63,72.42 31.73,73.31 29.67,73.31 28.85,73.31 27.29,74.88 Y1.P$4
REF_IN
  Top 0.254: R14.1 41.15,61.64 44.13,64.62 44.13,68.01 C2.1 44.23,68.39 43.7,68.92 STM32F303CB.26
  Top 0.508: R13.2 38,60.6 | 38,60.6 R11.1 | R15.2 40.14,60.56 | 40.14,60.56 R14.1 | 38,60.6 40.09,60.6 40.14,60.56
REFERENCE  (via drill 0.5)
  Top 0.254: C7.1 21.44,56.39 22.34,55.5 IC4.7 24.17,55.5 v25.14,56.46 | v35.45,55.68 36.35,55.68 37.28,54.76 39.17,54.76 42.17,57.76 42.17,58.41 42.65,58.89 43.49,58.89 45.05,57.34 C8.1 | C8.1 46.01,56.88 47.64,55.24 IC3.7 | C8.1 45.05,57.37 43.95,58.45 43.95,63.23 45.4,64.67 v45.56,64.67 | v43.18,67.32 42.5,68.01 STM32F303CB.25 41.53,68.42 41.25,68.7 41.25,69.07 v40.17,70.15 | STM32F303CB.18 STM32F303CB.19 38.5,68.11 v39.42,69.04
  Bottom 0.254: v25.14,56.46 29.18,56.46 29.96,55.68 v35.45,55.68 | v45.56,64.67 45.96,65.07 45.96,66.75 45.39,67.32 v43.18,67.32 | v39.42,69.04 40.17,69.79 v40.17,70.15
RFM_IRQ  (via drill 0.5)
  Top 0.203: v34.07,95.73 39.64,95.73 48.29,104.38 50.97,104.38 52.42,102.93 52.42,97.64 v52.94,97.11 | v54.59,95.59 56.47,95.59 57,95.06 U1.11
  Bottom 0.203: U$14.2 23.74,100.59 29.59,100.59 34.07,96.11 v34.07,95.73 | v52.94,97.11 54.46,95.59 v54.59,95.59
RST_STM  (via drill 0.5)
  Top 0.203: UART/STM.1 | UART/STM.1 44.56,97.9 39.11,92.45 39.11,80.96 38.03,79.88 v36.2,79.88 | v35.97,72.27 35.97,71.94 34.95,70.91 STM32F303CB.7 | U1.26 54.46,78.4 55.58,79.52 v55.58,82.99 | v55.27,85.12 55.27,90.31 53.29,92.3 52.18,92.3 51.3,93.17 51.3,95.49 50.08,96.71 46.06,96.71 UART/STM.1
  Bottom 0.203: v35.97,72.27 36.2,72.5 v36.2,79.88 | v55.58,82.99 55.58,84.82 v55.27,85.12
SCL
  Top 0.203: U1.36 67.16,71.17 70.26,68.07 72.79,68.07 SV1.2 SV2.2
SDA
  Top 0.203: U1.33 63.35,73.38 71.09,65.64 SV1.1 SV2.1
SOURCE_A
  Top 0.254: F2.1 20.66,33.93 19.7,32.97 19.02,32.97 19.55,32.44 EBW_B.P$2
  Top 0.508: EBW_B.P$2 20.34,35.49 SJ1.1
  pour Bottom (isolate 0.813, no thermals): 14.78,37.16 14.78,0.35 24.99,0.35 24.99,37.16
  pour Top (no thermals): 14.69,0.35 14.69,39.59 24.99,39.59 24.99,0.35
SOURCE_B
  Top 0.254: F4.1 46.06,33.28 44.8,32.01 45.31,32.01 EBW_A.P$25
  Top 0.508: EBW_A.P$2 40.32,37.97 SJ14.1
  pour Bottom (isolate 0.813, no thermals): 39.49,37.16 39.49,0.35 50.49,0.35 50.49,37.16
  pour Top (no thermals): 39.49,0.35 39.49,39.63 50.49,39.63 50.49,0.35
SOURCE_B_T
  Top 0.254: R36.2 48.49,53.87 IC3.8 46.3,53.98 C4.1
SOURCE_T_A
  Top 0.508: IC4.8 23.07,51.69 R12.2 20.89,53.87 C1.1
SPI_CLK  (via drill 0.5)
  Top 0.203: v41.28,101.07 42.3,101.07 44.22,103 44.5,103 47.15,105.64 51.65,105.64 54.27,103.02 54.27,98.85 v54.54,98.57 | v57.19,90.27 57.19,85.21 59.25,83.14 60.95,83.14 v61.02,83.08 | U1.30 59.54,78.2 61.82,80.48 v61.82,81.52 | 40.7,77.39 41.76,78.45 45.86,78.45 50.09,74.22 55.29,74.22 v56.12,73.39
  Top 0.254: STM32F303CB.39 40,76.68 40.7,77.39
  Bottom 0.203: U$14.13 41.24,101.11 v41.28,101.07 | v54.54,98.57 54.32,98.35 54.32,97.51 57.19,94.65 v57.19,90.27 | MICRO_SD.PIN5 61.02,84.35 v61.02,83.08 61.82,82.28 v61.82,81.52 | v56.12,73.39 59.54,76.81 U1.30
  other vias: 59.54,76.94
SPI_CS_MICROSD  (via drill 0.5)
  Top 0.203: v57.8,81.81 58.27,81.34 U1.29
  Bottom 0.203: MICRO_SD.PIN2 57.73,81.88 v57.8,81.81
SPI_CS_RFM  (via drill 0.5)
  Top 0.203: v41.34,99.11 41.54,99.11 44.77,102.34 44.77,102.73 47.3,105.26 51.49,105.26 53.89,102.86 53.89,95.14 54.46,94.57 U1.13
  Bottom 0.203: U$14.14 v41.34,99.11
SPI_CS_STM32  (via drill 0.5)
  Top 0.203: STM32F303CB.34 43.34,72.92 43.7,72.55 46.67,72.55 47.14,73.02 v47.14,75.03 | U1.16 50.81,89.88 50.47,89.54 50.47,84.62 49.41,83.56 45.77,83.56 45.06,82.84 45.06,80.85 45.91,80 46.7,80 47.3,79.39 v47.3,79.35
  Bottom 0.203: v47.14,75.03 47.14,79.19 v47.3,79.35
SPI_MISO  (via drill 0.5)
  Top 0.203: v32.32,96.53 39.82,96.53 45.15,101.86 45.15,102.57 47.46,104.88 51.33,104.88 53.51,102.7 53.51,99.36 53.11,98.96 v53.07,98.96 | v56.49,91.11 56.49,85.01 59.28,82.21 62.54,82.21 | 62.54,82.21 v63.22,82.89 | U1.31 60.81,77.09 | 60.81,77.09 60.81,78.66 62.56,80.41 62.56,82.2 62.54,82.21 | 40.2,77.5 41.53,78.83 46.02,78.83 50.25,74.6 59.43,74.6 60.82,75.99 60.82,77.08 60.81,77.09
  Top 0.254: STM32F303CB.40 39.5,76.79 40.2,77.5
  Bottom 0.203: U$14.1 23.77,98.56 28.55,98.56 30.58,96.53 v32.32,96.53 | v53.07,98.96 53.07,98.05 54.87,96.25 54.87,96.23 56.49,94.62 v56.49,91.11 | v56.49,91.11 | v63.22,82.89 63.22,84.35 MICRO_SD.PIN7
SPI_MOSI  (via drill 0.5)
  Top 0.203: v41.86,102.8 42.34,102.32 43.39,103.38 44.34,103.38 46.99,106.02 51.8,106.02 54.65,103.18 54.65,99.36 54.76,99.36 v54.92,99.52 | v58.01,91.1 57.89,90.97 57.89,86.32 v58.21,86 | U1.37 68.43,78.32 67.23,79.52 v64.59,79.52 | 39.65,77.55 41.3,79.21 46.17,79.21 50.4,74.98 58.7,74.98 v59.03,75.31
  Top 0.254: STM32F303CB.41 39,76.9 39.65,77.55
  Bottom 0.203: U$14.12 41.54,103.11 v41.86,102.8 | v54.92,99.52 55.24,99.21 55.24,97.27 57.86,94.64 57.86,91.38 58.01,91.23 v58.01,91.1 | v58.21,86 58.83,85.38 MICRO_SD.PIN3 58.83,80.42 59.73,79.52 60.36,79.52 | v64.59,79.52 60.36,79.52 | v59.03,75.31 60.36,76.64 60.36,79.52
STM_UART2_RX  (via drill 0.5)
  Top 0.203: 41.22,77.3 41.99,78.06 45.7,78.06 49.93,73.84 54.4,73.84 v54.98,73.25
  Top 0.254: STM32F303CB.38 40.5,76.57 41.22,77.3
  Bottom 0.203: v54.98,73.25 57,75.27 U1.28
  other vias: 57,76.94
STM_UART2_TX  (via drill 0.5)
  Top 0.203: 41.62,77.09 42.22,77.68 45.54,77.68 49.77,73.45 53.55,73.45 v53.88,73.12
  Top 0.254: STM32F303CB.37 41,76.46 41.62,77.09
  Bottom 0.203: v53.88,73.12 55.73,74.96 U1.27
  other vias: 55.73,76.94
THERM
  Top 0.254: X2.2 71.86,49.44 C25.1 67.61,49.46 R41.1 67.61,53.23 64.79,56.05 64.79,59.77 56.04,68.52 49.88,68.52 48.92,69.47 47.16,69.47 46.9,69.21 44.02,69.21 43.88,69.35 43.78,69.35 43.76,69.35 43.69,69.42 STM32F303CB.27
USART1_RX  (via drill 0.5)
  Top 0.203: STM32F303CB.31 41.64,71.42 v40.99,72.07 | v39.7,78.62 41.77,80.7 41.77,88.55 v42.17,88.94
  Bottom 0.203: v40.99,72.07 39.7,73.35 v39.7,78.62 | v42.17,88.94 42.17,91.16 43.83,92.82 UART/STM.3
USART1_TX  (via drill 0.5)
  Top 0.203: STM32F303CB.30 41.2,70.92 v40.04,72.08 | v38.86,78.1 38.86,78.89 41.17,81.2 v41.17,89.36
  Bottom 0.203: v40.04,72.08 38.86,73.26 v38.86,78.1 | v41.17,89.36 41.17,93.68 42.85,95.36 UART/STM.2
V+_A
  Top 0.406: U$15.P$2 8.39,36.22 7.7,36.92 SJ15.3 7.7,48.27 11.12,51.37 11.12,60.97 9.44,62.66 R10.1
V+_B
  Top 0.254: SJ15.1 10.77,46.73
  Top 0.406: R30.1 12.7,48.66 10.77,46.73 10.77,46.71 | SJ15.1 10.74,38.21 13.95,35.01 13.95,28.95 U$15.P$1
V_IN_POSTFUSE
  Top 1.27: F1.P$3 2.38,61.21 U$2.P$2
  Top 1.778: F1.P$4 3.51,57.37 | 3.51,57.37 F1.P$3 | 3.51,57.37 D1.C | U$2.P$2 U$2.P$1
VBAT  (via drill 0.5)
  Top 0.254: v33.01,74.44 33.47,74.44 STM32F303CB.1
  Bottom 0.254: CR1220.P+ 33.01,73.57 v33.01,74.44
VSENSE_A  (via drill 0.5)
  Top 0.254: R1.2 8.14,74.15 R2.2 | R2.2 6.78,74.24 U$1.P$1 | R2.2 8.23,76.55 C21.1 | v16.36,72.04 17.13,72.82 D6.1 25.21,72.82 28.62,69.41 32.57,69.41 32.58,69.42 STM32F303CB.10
  Bottom 0.254: R1.2 9.47,73.16 15.24,73.16 v16.36,72.04
VSENSE_B
  Top 0.254: C20.1 R4.2 14.96,74.3 U$4.P$1 13.47,74.18 R3.2 14.01,71.06 16.66,71.06 17.2,71.59 D9.1 25.27,71.59 27.95,68.92 STM32F303CB.11

### Text on the board
tPlace: GND
bPlace: Technology that helps us live within ecological limits | emonDC | wireless energy monitoring node | Open / Hardware | Designed in / North Wales / by Daniel Bates | OpenEnergyMonitor.org
tNames: emonDC / _duo_ | +OUT | RST | 5V | Tx | Rx | 5V | 5V_IN | STM | ESP | GND | GND | 3V3 | SCL | SDA | Wireless Energy / Monitoring Node | I2C | +6.5V_IN | Vsense | TR5 / FUSES | Vcc | Vcc | Vout | Vout | A | GND | Vsense | GND | GND | B | DC/STM_v0.2 / Nov 2020 / by DB | 1 | A | 2 | 1 | B | 2
bNames: 5V | 3V3 | 5V | 3V3
tValues: x. 76.71mm / y. 116.71mm
_tsilk: Designed in | North Wales | Made in UK
_bsilk: SMT V0.6 rev3 | emonTx | wireless energy monitoring node | SMT V0.6 rev3 | emonTx | SMT V0.6 rev3 | emonTx | Technology that helps us live within ecological limits | wireless energy monitoring node | wireless energy monitoring node | Designed in North Wales UK by Glyn Hudson & Trystan Lea | Technology that helps us live within ecological limits | Technology that helps us live within ecological limits | Designed in North Wales UK by Glyn Hudson & Trystan Lea | 165mm ant | 433Mhz | Designed in North Wales UK by Glyn Hudson & Trystan Lea | 165mm ant | 165mm ant | 433Mhz | 433Mhz | 868Mhz | 82mm ant | 82mm ant | 82mm ant | 868Mhz | 868Mhz | 78mm ant | 915Mhz | 78mm ant | 915Mhz | 78mm ant | 915Mhz | 165mm ant | 433Mhz | 82mm ant | 868Mhz | 78mm ant | 915Mhz